# Altium project Taksimetre.PrjPcb (part 1 of 2)
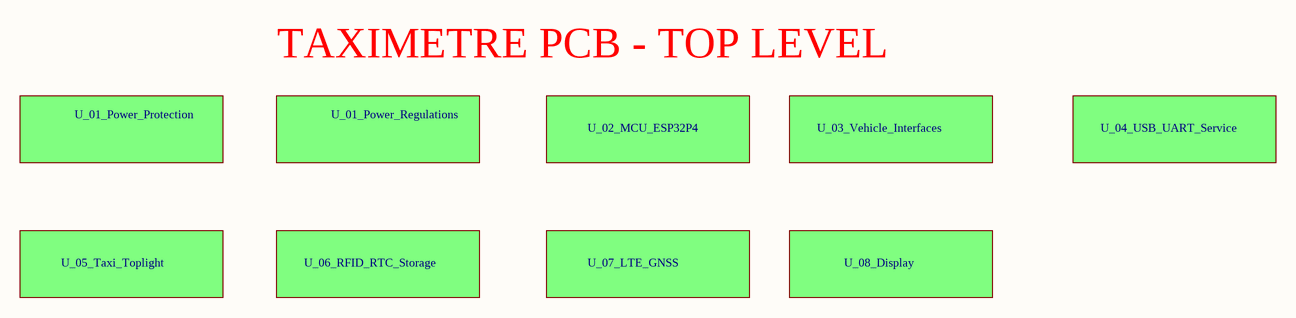
[diagram p0: Taksimetre.SchDoc]
10 sheets, 217 parts. Net scope: flat (ports and power ports of the same name join across sheets).
Sheets:
  Taksimetre.SchDoc
    U_01_Power_Protection = 01_Power_Protection.SchDoc
    U_02_MCU_ESP32P4 = 02_MCU_ESP32P4.SchDoc
    U_03_Vehicle_Interfaces = 03_Vehicle_Interfaces.SchDoc
    U_04_USB_UART_Service = 04_USB_UART_Service.SchDoc
    U_05_Taxi_Toplight = 05_Taxi_Toplight.SchDoc
    U_06_RFID_RTC_Storage = 06_RFID_RTC_Storage.SchDoc
    U_07_LTE_GNSS = 07_LTE_GNSS.SchDoc
    U_08_Display = 08_Display.SchDoc
    U_01_Power_Regulations = 01_Power_Regulations.SchDoc

## Sheet Taksimetre.SchDoc: TAXIMETRE_PCB_MAIN
size A4; Author: YILDIRIM_DOGRU; CompanyName: BARFAS; DrawnBy: YILDIRIM_DOGRU; DocumentNumber: 0

### Sub-sheets
U_01_Power_Protection = 01_Power_Protection.SchDoc: no entries
U_01_Power_Regulations = 01_Power_Regulations.SchDoc: no entries
U_02_MCU_ESP32P4 = 02_MCU_ESP32P4.SchDoc: no entries
U_03_Vehicle_Interfaces = 03_Vehicle_Interfaces.SchDoc: no entries
U_04_USB_UART_Service = 04_USB_UART_Service.SchDoc: no entries
U_05_Taxi_Toplight = 05_Taxi_Toplight.SchDoc: no entries
U_06_RFID_RTC_Storage = 06_RFID_RTC_Storage.SchDoc: no entries
U_07_LTE_GNSS = 07_LTE_GNSS.SchDoc: no entries
U_08_Display = 08_Display.SchDoc: no entries

### Notes on the sheet
- TAXIMETRE PCB - TOP LEVEL
- Title
- Size:
- Date:
- A4
- Drawn By:
- Number:
- Revision:
- File:

## Sheet 01_Power_Protection.SchDoc: POWER
size A4; DrawnBy: YILDIRIM_DOGRU
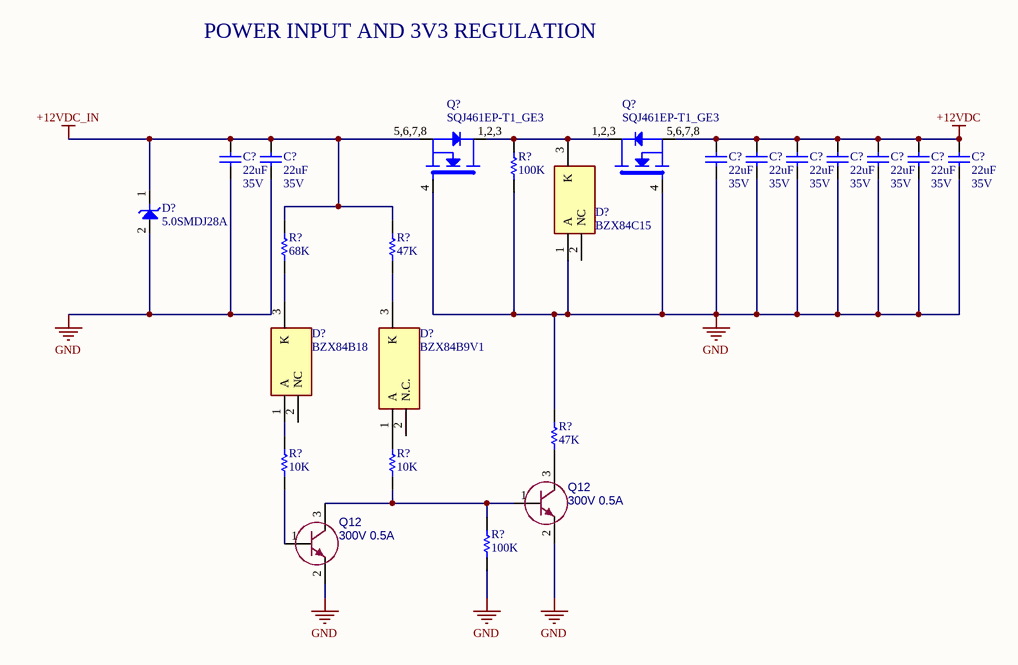
[diagram p1: 01_Power_Protection.SchDoc]

### Parts
(Parts that share a designator on the sheet are numbered #1, #2 ... from top to bottom, then left to right.)
C?#1  value 22uF  Voltage: 35V  [CAP_0805]  (hidden comment: GMC21X5R226M35NT)
C?#2  value 22uF  Voltage: 35V  [CAP_0805]  (hidden comment: GMC21X5R226M35NT)
C?#3  value 22uF  Voltage: 35V  [CAP_0805]  (hidden comment: GMC21X5R226M35NT)
C?#4  value 22uF  Voltage: 35V  [CAP_0805]  (hidden comment: GMC21X5R226M35NT)
C?#5  value 22uF  Voltage: 35V  [CAP_0805]  (hidden comment: GMC21X5R226M35NT)
C?#6  value 22uF  Voltage: 35V  [CAP_0805]  (hidden comment: GMC21X5R226M35NT)
C?#7  value 22uF  Voltage: 35V  [CAP_0805]  (hidden comment: GMC21X5R226M35NT)
C?#8  value 22uF  Voltage: 35V  [CAP_0805]  (hidden comment: GMC21X5R226M35NT)
C?#9  value 22uF  Voltage: 35V  [CAP_0805]  (hidden comment: GMC21X5R226M35NT)
D?#1  5.0SMDJ28A  [SMCJ58A]
D?#2  BZX84C15  [SOT95P240X120-3N]
D?#3  BZX84B18  [SOT95P240X110-3N]
D?#4  BZX84B9V1  [SOT95P240X110-3N]
Q12#1  value 300V 0.5A  [SOT-23-3]  (hidden comment: MMBTA42_R1_00001)
Q12#2  value 300V 0.5A  [SOT-23-3]  (hidden comment: MMBTA42_R1_00001)
Q?#1  SQJ461EP-T1_GE3  [SOT323]
Q?#2  SQJ461EP-T1_GE3  [SOT323]
R?#1  value 100K  [RES_0402]  (hidden comment: 0402WGF1003TCE)
R?#2  value 68K  [RES_0402]  (hidden comment: 0402WGF6802TCE)
R?#3  value 47K  [RES_0603]  (hidden comment: 0603SAF4702T5E)
R?#4  value 47K  [RES_0603]  (hidden comment: 0603SAF4702T5E)
R?#5  value 10K  [RES_0402]  (hidden comment: RC0402JR-0710KL)
R?#6  value 10K  [RES_0402]  (hidden comment: RC0402JR-0710KL)
R?#7  value 100K  [RES_0402]  (hidden comment: 0402WGF1003TCE)

### Nets
+12VDC: C?#3.1 C?#4.1 C?#5.1 C?#6.1 C?#7.1 C?#8.1 C?#9.1 Q?#2.5,6,7,8(S)
+12VDC_IN: C?#1.1 C?#2.1 D?#1.1 Q?#1.5,6,7,8(S) R?#2.2 R?#3.2
GND: C?#1.2 C?#2.2 C?#3.2 C?#4.2 C?#5.2 C?#6.2 C?#7.2 C?#8.2 C?#9.2 D?#1.2 D?#2.1(A) Q12#1.2(E) Q12#2.2(E) Q?#1.4(G) Q?#2.4(G) R?#1.1 R?#4.2 R?#7.1  [project net TVSS]
NetD?#2_3: D?#2.3(K) Q?#1.1,2,3(D) Q?#2.1,2,3(D) R?#1.2
NetD?#3_1: D?#3.1(A) R?#5.2
NetD?#3_3: D?#3.3(K) R?#2.1
NetD?#4_1: D?#4.1(A) R?#6.2
NetD?#4_3: D?#4.3(K) R?#3.1
NetQ12#1_1: Q12#1.1(B) Q12#2.3(C) R?#6.1 R?#7.2
NetQ12#1_3: Q12#1.3(C) R?#4.1
NetQ12#2_1: Q12#2.1(B) R?#5.1

Not connected (* = marked no-connect by the designer): D?#2 2(NC); D?#3 2(NC); D?#4 2(N.C.)

### Notes on the sheet
- POWER INPUT AND 3V3 REGULATION
- Title
- Size:
- Date:
- A4
- Drawn By:
- Number:
- Revision:
- File:

### Library data of the parts
C?#1-C?#9 = C01758: 22 µF ±20% 35V Ceramic Capacitor X5R 0805 (2012 Metric); Manufacturer: Cal-Chip Electronics, Inc.; Manufacturer Part Number: GMC21X5R226M35NT
D?#1 = 5.0SMDJ28A: 45.4V Clamp 110A Ipp Tvs Diode Surface Mount DO-214AB (SMC); Manufacturer: Bourns Inc.; Datasheet Link: https://www.diodes.com/part/view/SMCJ58A; Height: 2.5mm; Manufacturer Part Number: 5.0SMDJ28A; Mouser Part Number: N/A; Mouser Price/Stock: https://www.mouser.co.uk/ProductDetail/Diodes-Incorporated/SMCJ58A?qs=evjyFmOIEsnFZCuxUMyzBg%3D%3D
D?#2 = BZX84C15: Zener Diode; Manufacturer: Diotec; Manufacturer Part Number: BZX84C15
D?#3 = BZX84B18: Zener Diode; Manufacturer: PANJIT; Manufacturer Part Number: BZX84B18
D?#4 = BZX84B9V1: Zener Diode; Manufacturer: PANJIT; Manufacturer Part Number: BZX84B9V1
Q12#1 Q12#2 = MMBTA42_R1_00001: TRANSISTOR DIS.500mA 300V NPN SOT23 GEN. SMT; Manufacturer: PANJIT; Package: SOT23; Supplier Part Number 1: 3757-MMBTA42_R1_00001CT-ND; Supplier Part Number 2: *; Supplier Part Number 3: MMBTA42_R1_00001; Supplier 1: DIGIKEY; Supplier 2: MOUSER; Supplier 3: OZDISAN; Manufacturer Part Number: MMBTA42_R1_00001
Q?#1 Q?#2 = SQJ461EP-T1_GE3: P-Channel 60 V 30A (Tc) 83W (Tc) Surface Mount PowerPAK® SO-8; Manufacturer: Vishay Siliconix; Value: *; Supplier 1: OZDISAN; Manufacturer Part Number: SQJ461EP-T1_GE3
R?#1 R?#7 = R03000: RES.(1005) 0402 100K Ohms 1% 1/16W 100PPM; Manufacturer: ROYALOHM; Manufacturer Part Number: 0402WGF1003TCE
R?#2 = R03000: RES.(1005) 0402 68K Ohms 1% 1/16W 100PPM; Manufacturer: ROYALOHM; Manufacturer Part Number: 0402WGF6802TCE
R?#3 R?#4 = 0603SAF4702T5E: RES.(1608) 0603 47K Ohms 1% 1/10W-S 100PPM; Manufacturer: ROYALOHM; Supplier 1: Ozdisan; Manufacturer Part Number: 0603SAF4702T5E
R?#5 R?#6 = R03000: RES.(1005) 0402 10K Ohms 5% 1/16W 100PPM SMT; Manufacturer: YAGEO; Manufacturer Part Number: RC0402JR-0710KL

## Sheet 02_MCU_ESP32P4.SchDoc: MCU_ESP32P4
size A3; DrawnBy: YILDIRIM_DOGRU
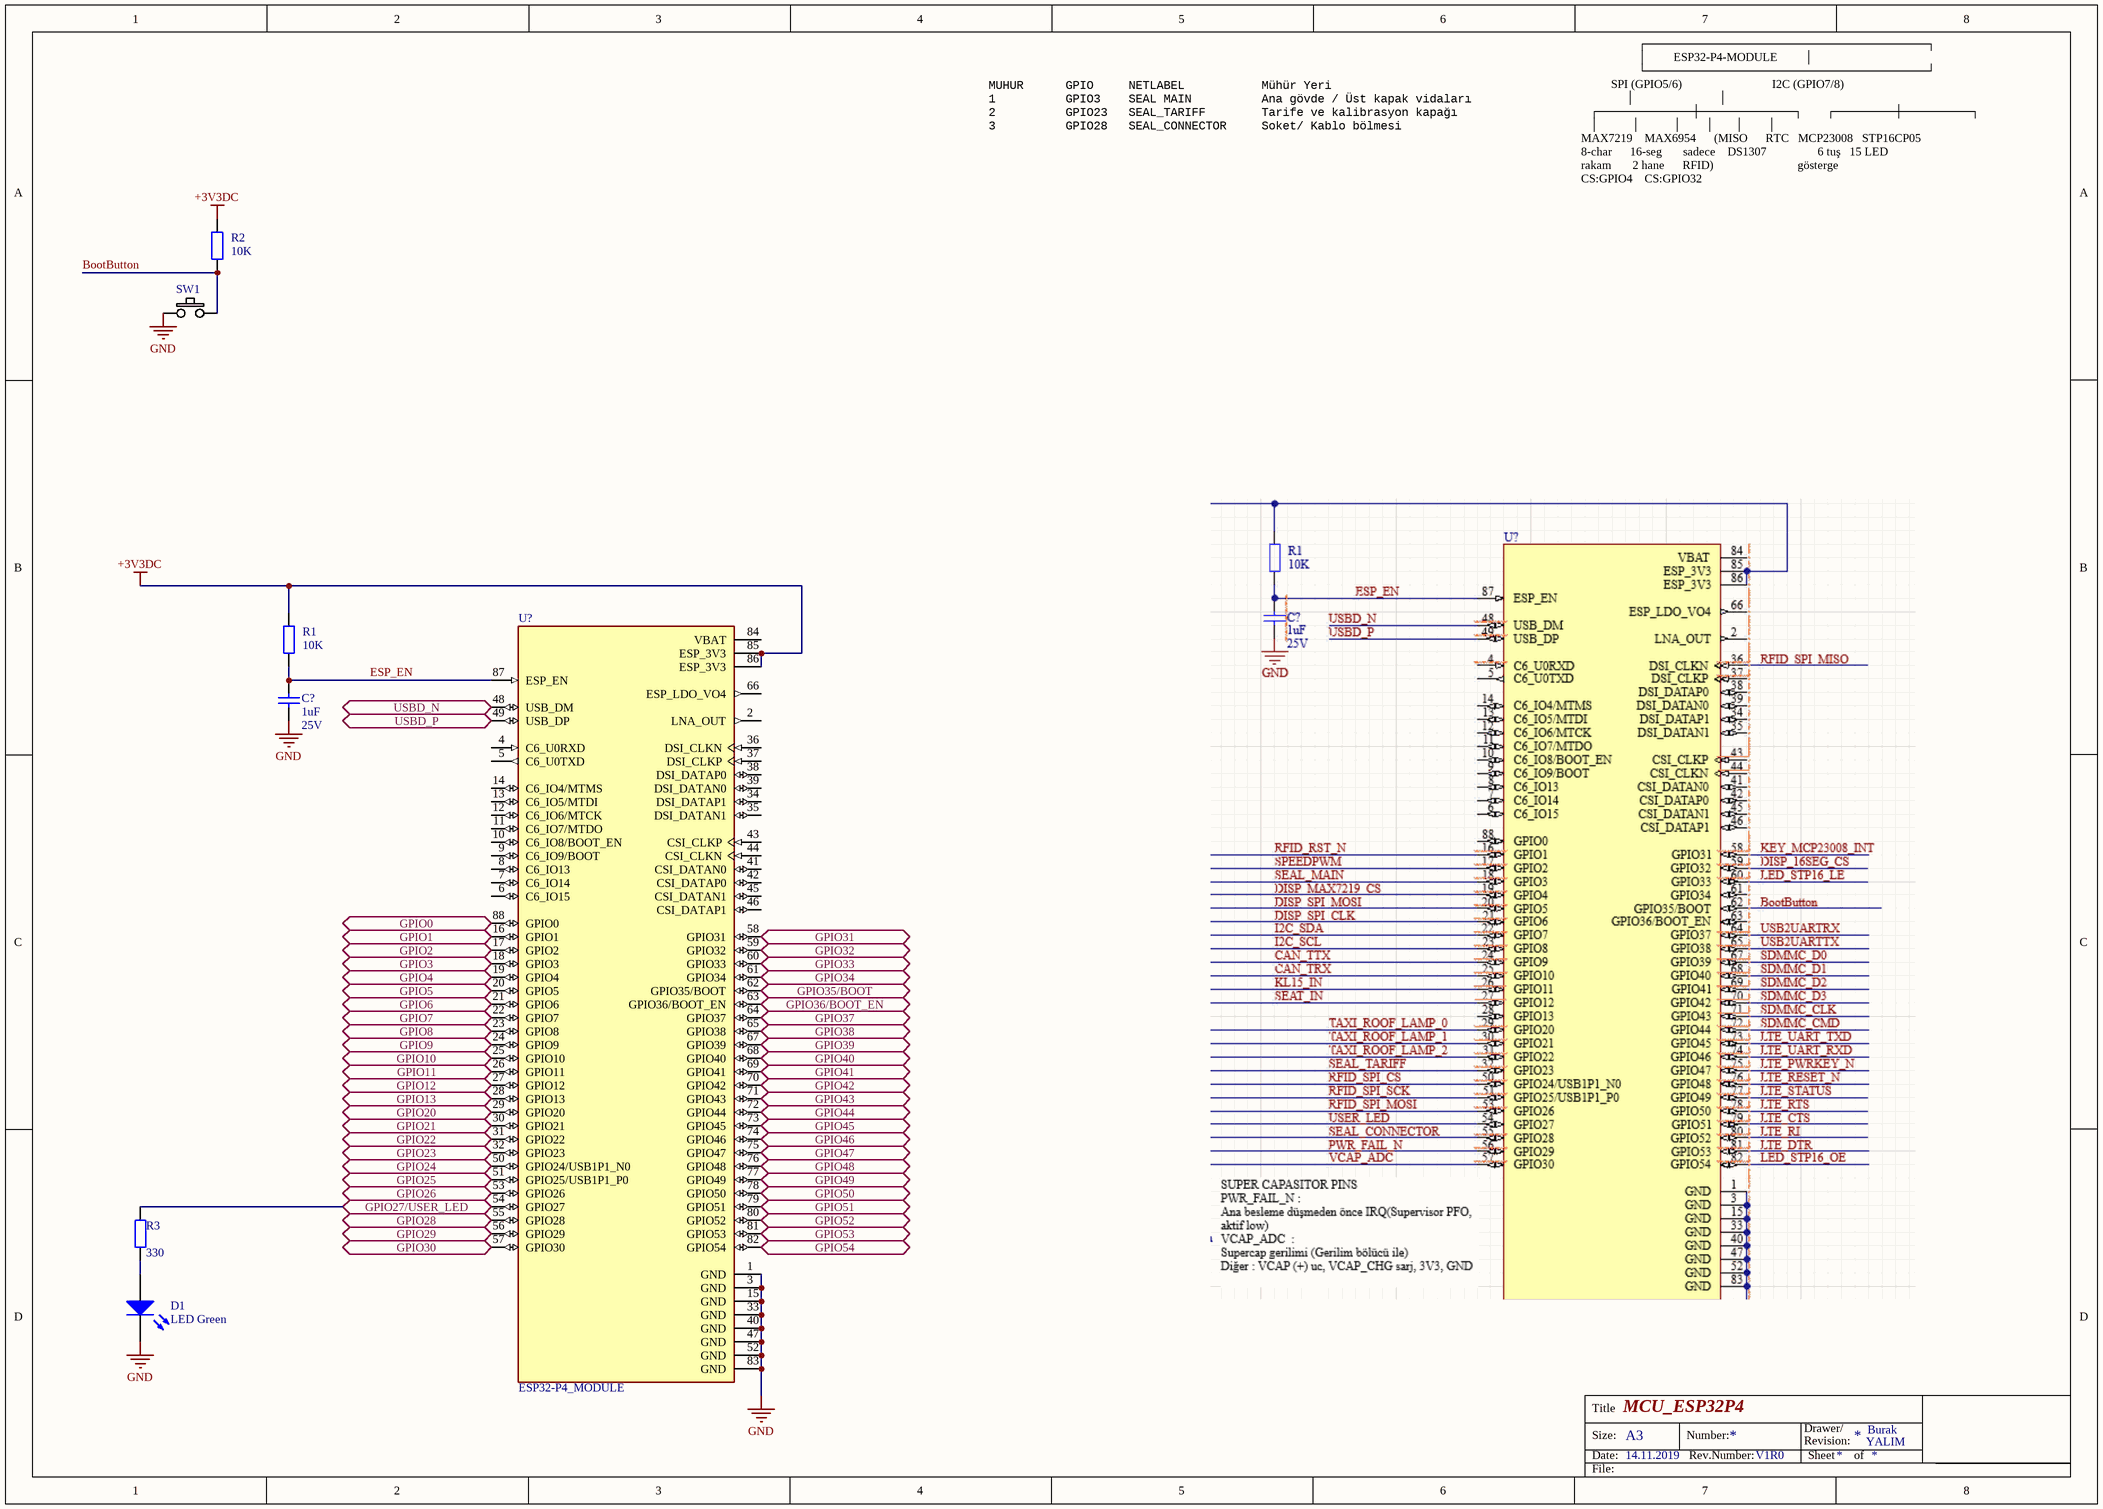
[diagram p2: 02_MCU_ESP32P4.SchDoc]

### Parts
(Parts that share a designator on the sheet are numbered #1, #2 ... from top to bottom, then left to right.)
C?#10  value 1uF  Voltage: 25V  [CAP_0603]  (hidden comment: CL10A105KA8NNNC)
D1#1  LED Green  [LED-1]
R1#1  value 10K  [AXIAL-0.4]  (hidden comment: R_CS)
R2#1  value 10K  [AXIAL-0.4]  (hidden comment: R_CS)
R3#1  value 330  [AXIAL-0.4]  (hidden comment: RG)
SW1#1  SW-PB-BLACK-SMD  [SW-PB-SMD]  (value not drawn)
U?#1  ESP32-P4_MODULE  [XCVR_ESP32-P4_MODULE]

### Ports
GPIO0 (bidir), GPIO1 (bidir), GPIO2 (bidir), GPIO3 (bidir), GPIO4 (bidir), GPIO5 (bidir), GPIO6 (bidir), GPIO7 (bidir), GPIO8 (bidir), GPIO9 (bidir), GPIO10 (bidir), GPIO11 (bidir), GPIO12 (bidir), GPIO13 (bidir), GPIO20 (bidir), GPIO21 (bidir), GPIO22 (bidir), GPIO23 (bidir), GPIO24 (bidir), GPIO25 (bidir), GPIO26 (bidir), GPIO27/USER_LED (bidir), GPIO28 (bidir), GPIO29 (bidir), GPIO30 (bidir), GPIO31 (bidir), GPIO32 (bidir), GPIO33 (bidir), GPIO34 (bidir), GPIO35/BOOT (bidir), GPIO36/BOOT_EN (bidir), GPIO37 (bidir), GPIO38 (bidir), GPIO39 (bidir), GPIO40 (bidir), GPIO41 (bidir), GPIO42 (bidir), GPIO43 (bidir), GPIO44 (bidir), GPIO45 (bidir), GPIO46 (bidir), GPIO47 (bidir), GPIO48 (bidir), GPIO49 (bidir), GPIO50 (bidir), GPIO51 (bidir), GPIO52 (bidir), GPIO53 (bidir), GPIO54 (bidir), USBD_N (bidir), USBD_P (bidir)

### Nets
+3V3DC: R1#1.2 R2#1.2 U?#1.85(ESP_3V3) U?#1.86(ESP_3V3)
GND: C?#10.2 D1#1.2(K) SW1#1.1 U?#1.1(GND) U?#1.3(GND) U?#1.15(GND) U?#1.33(GND) U?#1.40(GND) U?#1.47(GND) U?#1.52(GND) U?#1.83(GND)  [project net TVSS]
BootButton: R2#1.1 SW1#1.2
ESP_EN: C?#10.1 R1#1.1 U?#1.87(ESP_EN)
USBD_N: U?#1.48(USB_DM) ; port USBD_N
USBD_P: U?#1.49(USB_DP) ; port USBD_P
NetD1#1_1: D1#1.1(A) R3#1.1
NetR3#1_2: R3#1.2 U?#1.54(GPIO27) ; port GPIO27/USER_LED
NetU?#1_16: U?#1.16(GPIO1) ; port GPIO1
NetU?#1_17: U?#1.17(GPIO2) ; port GPIO2
NetU?#1_18: U?#1.18(GPIO3) ; port GPIO3
NetU?#1_19: U?#1.19(GPIO4) ; port GPIO4
NetU?#1_20: U?#1.20(GPIO5) ; port GPIO5
NetU?#1_21: U?#1.21(GPIO6) ; port GPIO6
NetU?#1_22: U?#1.22(GPIO7) ; port GPIO7
NetU?#1_23: U?#1.23(GPIO8) ; port GPIO8
NetU?#1_24: U?#1.24(GPIO9) ; port GPIO9
NetU?#1_25: U?#1.25(GPIO10) ; port GPIO10
NetU?#1_26: U?#1.26(GPIO11) ; port GPIO11
NetU?#1_27: U?#1.27(GPIO12) ; port GPIO12
NetU?#1_28: U?#1.28(GPIO13) ; port GPIO13
NetU?#1_29: U?#1.29(GPIO20) ; port GPIO20
NetU?#1_30: U?#1.30(GPIO21) ; port GPIO21
NetU?#1_31: U?#1.31(GPIO22) ; port GPIO22
NetU?#1_32: U?#1.32(GPIO23) ; port GPIO23
NetU?#1_50: U?#1.50(GPIO24/USB1P1_N0) ; port GPIO24
NetU?#1_51: U?#1.51(GPIO25/USB1P1_P0) ; port GPIO25
NetU?#1_53: U?#1.53(GPIO26) ; port GPIO26
NetU?#1_55: U?#1.55(GPIO28) ; port GPIO28
NetU?#1_56: U?#1.56(GPIO29) ; port GPIO29
NetU?#1_57: U?#1.57(GPIO30) ; port GPIO30
NetU?#1_58: U?#1.58(GPIO31) ; port GPIO31
NetU?#1_59: U?#1.59(GPIO32) ; port GPIO32
NetU?#1_60: U?#1.60(GPIO33) ; port GPIO33
NetU?#1_61: U?#1.61(GPIO34) ; port GPIO34
NetU?#1_62: U?#1.62(GPIO35/BOOT) ; port GPIO35/BOOT
NetU?#1_63: U?#1.63(GPIO36/BOOT_EN) ; port GPIO36/BOOT_EN
NetU?#1_64: U?#1.64(GPIO37) ; port GPIO37
NetU?#1_65: U?#1.65(GPIO38) ; port GPIO38
NetU?#1_67: U?#1.67(GPIO39) ; port GPIO39
NetU?#1_68: U?#1.68(GPIO40) ; port GPIO40
NetU?#1_69: U?#1.69(GPIO41) ; port GPIO41
NetU?#1_70: U?#1.70(GPIO42) ; port GPIO42
NetU?#1_71: U?#1.71(GPIO43) ; port GPIO43
NetU?#1_72: U?#1.72(GPIO44) ; port GPIO44
NetU?#1_73: U?#1.73(GPIO45) ; port GPIO45
NetU?#1_74: U?#1.74(GPIO46) ; port GPIO46
NetU?#1_75: U?#1.75(GPIO47) ; port GPIO47
NetU?#1_76: U?#1.76(GPIO48) ; port GPIO48
NetU?#1_77: U?#1.77(GPIO49) ; port GPIO49
NetU?#1_78: U?#1.78(GPIO50) ; port GPIO50
NetU?#1_79: U?#1.79(GPIO51) ; port GPIO51
NetU?#1_80: U?#1.80(GPIO52) ; port GPIO52
NetU?#1_81: U?#1.81(GPIO53) ; port GPIO53
NetU?#1_82: U?#1.82(GPIO54) ; port GPIO54
NetU?#1_88: U?#1.88(GPIO0) ; port GPIO0

Not connected (* = marked no-connect by the designer): U?#1 2(LNA_OUT) 4(C6_U0RXD) 5(C6_U0TXD) 6(C6_IO15) 7(C6_IO14) 8(C6_IO13) 9(C6_IO9/BOOT) 10(C6_IO8/BOOT_EN) 11(C6_IO7/MTDO) 12(C6_IO6/MTCK) 13(C6_IO5/MTDI) 14(C6_IO4/MTMS) 34(DSI_DATAP1) 35(DSI_DATAN1) 36(DSI_CLKN) 37(DSI_CLKP) 38(DSI_DATAP0) 39(DSI_DATAN0) 41(CSI_DATAN0) 42(CSI_DATAP0) 43(CSI_CLKP) 44(CSI_CLKN) 45(CSI_DATAN1) 46(CSI_DATAP1) 66(ESP_LDO_VO4) 84(VBAT)

### Notes on the sheet
- MUHUR      GPIO     NETLABEL           Mühür Yeri
  1          GPIO3    SEAL MAIN          Ana gövde / Üst kapak vidaları
  2          GPIO23   SEAL_TARIFF        Tarife ve kalibrasyon kapağı
  3          GPIO28   SEAL_CONNECTOR     Soket/ Kablo bölmesi
- ┌─────────────────────────────────┐
  │         ESP32-P4-MODULE         │
  └─────────────────────────────────┘
  SPI (GPIO5/6)                              I2C (GPIO7/8)
  │                            │
  ┌───────────┼───────────┐        ┌───────┼────────┐
  │           │           │        │       │        │
  MAX7219    MAX6954      (MISO      RTC   MCP23008   STP16CP05
  8-char      16-seg       sadece    DS1307                 6 tuş   15 LED
  rakam       2 hane      RFID)                            gösterge
  CS:GPIO4    CS:GPIO32
- Title
- Size:
- Date:
- 14.11.2019
- A3
- Number:
- Rev.Number:
- V1R0
- Revision:
- Drawer/
- Sheet
- of
- YALIM
- Burak
- File:

### Library data of the parts
C?#10 = C01757: CAP CER 1UF 25VDC %10 X5R SMD; Manufacturer: Samsung; Manufacturer Part Number: CL10A105KA8NNNC
D1#1 = LED1: Typical RED GaAs LED; Published: 8-Jun-2000; LatestRevisionDate: 08-Jul-2005; LatestRevisionNote: Mech Layer 1 removed.; PackageReference: LED-1; Publisher: Altium Limited; PackageDescription: LED; 2 Leads
R1#1 R2#1 R3#1 = Res2: Resistor; Published: 8-Jun-2000; LatestRevisionDate: 17-Jul-2002; LatestRevisionNote: Re-released for DXP Platform.; PackageReference: AXIAL-0.4; Publisher: Altium Limited; PackageDescription: Axial Device, Thru-Hole; 2 Leads; 0.4 in Pin Spacing
SW1#1 = SW-PB-BLACK-SMD: PUSHBUTTON SWITCH 6MM SMD
U?#1 = ESP32-P4_MODULE: Dual-core RISC-V high-performance module ESP32-C6H8; Manufacturer: Waveshare Electronics; Manufacturer Part Number: ESP32-P4 Module; Value: *

## Sheet 03_Vehicle_Interfaces.SchDoc: Vehicle Interfaces
size A4; DrawnBy: YILDIRIM_DOGRU
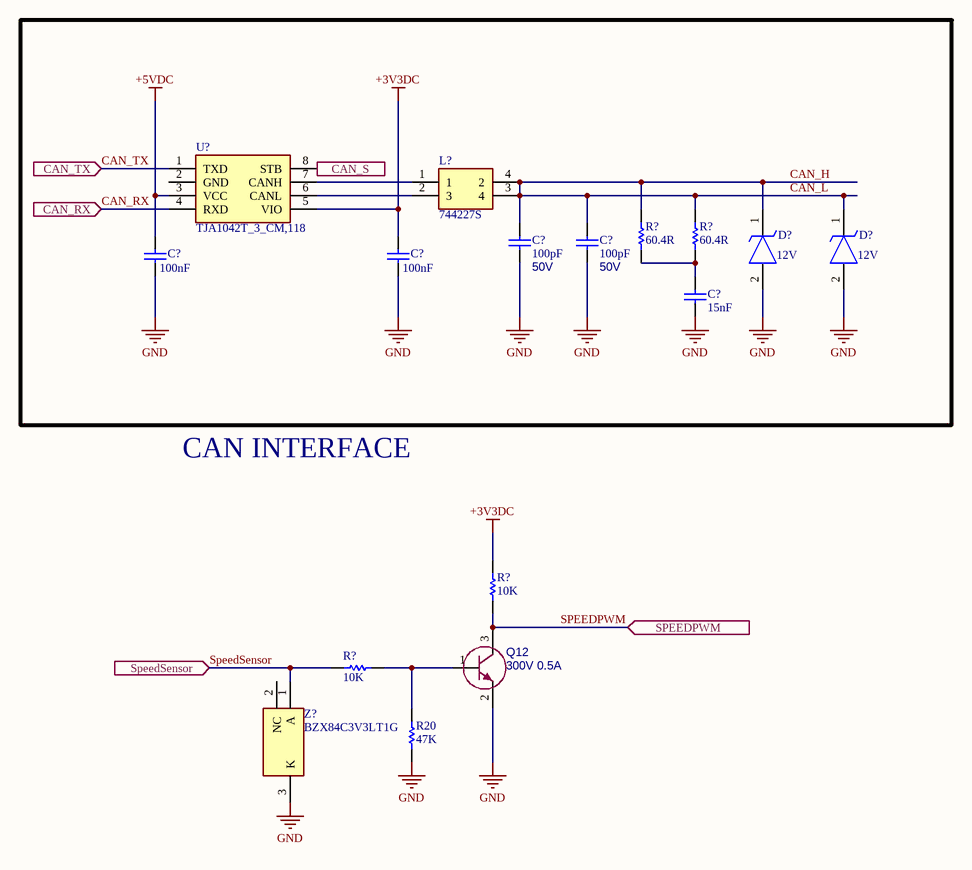
[diagram p3: 03_Vehicle_Interfaces.SchDoc]

### Parts
(Parts that share a designator on the sheet are numbered #1, #2 ... from top to bottom, then left to right.)
C?#11  value 100pF  Voltage: 50V  [CAP_0402]  (hidden comment: CC0402JRNPO9BN101)
C?#12  value 100pF  Voltage: 50V  [CAP_0402]  (hidden comment: CC0402JRNPO9BN101)
C?#13  value 100nF  [CAP_0603]  (hidden comment: CL10B104KB8NNNL)
C?#14  value 100nF  [CAP_0603]  (hidden comment: CL10B104KB8NNNL)
C?#15  value 15nF  [CAP_0603]  (hidden comment: CL10B153KB85PNC)
D?#5  value 12V  [DIOM5436X244N]  (hidden comment: SMBJ12A)
D?#6  value 12V  [DIOM5436X244N]  (hidden comment: SMBJ12A)
L?#1  744227S  [WE-SL274]
Q12#3  value 300V 0.5A  [SOT-23-3]  (hidden comment: MMBTA42_R1_00001)
R20#1  value 47K  [RES_0603]  (hidden comment: 0603SAF4702T5E)
R?#8  value 60.4R  [RES_0603]  (hidden comment: 0603SAF604JT5E)
R?#9  value 60.4R  [RES_0603]  (hidden comment: 0603SAF604JT5E)
R?#10  value 10K  [RES_0402]  (hidden comment: RC0402JR-0710KL)
R?#11  value 10K  [RES_0402]  (hidden comment: RC0402JR-0710KL)
U?#2  TJA1042T_3_CM,118  [SOIC127P600X175-8N]
Z?  BZX84C3V3LT1G  [SOT96P237X111-3N]

### Ports
CAN_RX (in), CAN_S (in), CAN_TX (in), SPEEDPWM (in), SpeedSensor (in)

### Nets
+3V3DC: C?#14.2 R?#10.1 U?#2.5(VIO)
+5VDC: C?#13.2 U?#2.3(VCC)
GND: C?#11.2 C?#12.2 C?#13.1 C?#14.1 C?#15.1 D?#5.2(A) D?#6.2(A) Q12#3.2(E) R20#1.1 Z?.3(K)  [project net TVSS]
CAN_H: C?#11.1 C?#12.1 D?#5.1(K) D?#6.1(K) L?#1.3(4) L?#1.4(2) R?#8.2 R?#9.2  [also labelled CAN_L]
CAN_RX: U?#2.4(RXD) ; port CAN_RX
CAN_TX: U?#2.1(TXD) ; port CAN_TX
SPEEDPWM: Q12#3.3(C) R?#10.2 ; port SPEEDPWM
SpeedSensor: R?#11.1 Z?.1(A) ; port SpeedSensor
NetC?#15_2: C?#15.2 R?#8.1 R?#9.1
NetL?#1_1: L?#1.1 U?#2.7(CANH)
NetL?#1_2: L?#1.2(3) U?#2.6(CANL)
NetQ12#3_1: Q12#3.1(B) R20#1.2 R?#11.2
NetU?#2_8: U?#2.8(STB) ; port CAN_S

Not connected (* = marked no-connect by the designer): U?#2 2(GND); Z? 2(NC)

### Notes on the sheet
- CAN INTERFACE
- Title
- Size:
- Date:
- A4
- Drawn By:
- Number:
- Revision:
- File:

### Library data of the parts
C?#11 C?#12 = CL10B103KB8NNNL: MLCC (1005) 0402 100pF 50VDC ±5% C0G (NP0); Manufacturer: YAGEO; Manufacturer Part Number: CC0402JRNPO9BN101
C?#13 C?#14 = CL10B104KB8NNNL: MLCC (1608) 0603 100nF 50VDC ±10% X7R; Manufacturer: Samsung Electro-Mechanics America, Inc; Supplier 1: OZDISAN; Manufacturer Part Number: CL10B104KB8NNNL
C?#15 = CL10B153KB85PNC: MLCC (1608) 0603 15nF 50VDC ±10% X7R AUTOMOTIVE; Manufacturer: SAMSUNG; Supplier 1: OZDISAN; Manufacturer Part Number: CL10B153KB85PNC
D?#5 D?#6 = SMBJ12A: TVS, UNI-DIR, 600W, 12V, DO-214A; Manufacturer: Good-Ark Semiconductor; Manufacturer Part Number: SMBJ12A
L?#1 = 744227S: Inductor; Manufacturer_Name: Wurth Elektronik; Datasheet Link: https://www.we-online.com/catalog/datasheet/744227S.pdf; Height: 5mm; Manufacturer_Part_Number: 744227S; Mouser Part Number: 710-744227S; Mouser Price/Stock: https://www.mouser.co.uk/ProductDetail/Wurth-Elektronik/744227S?qs=PGXP4M47uW6UzRbcLRn7mw%3D%3D
Q12#3 = MMBTA42_R1_00001: as Q12#1 on sheet 01_Power_Protection; Package: SOT23; Supplier Part Number 1: 3757-MMBTA42_R1_00001CT-ND; Supplier Part Number 2: *; Supplier Part Number 3: MMBTA42_R1_00001; Supplier 1: DIGIKEY; Supplier 2: MOUSER; Supplier 3: OZDISAN; Manufacturer Part Number: MMBTA42_R1_00001
R20#1 = 0603SAF4702T5E: as R?#3 on sheet 01_Power_Protection; Supplier 1: Ozdisan; Manufacturer Part Number: 0603SAF4702T5E
R?#8 R?#9 = 0603SAJ0220T5E: RES.(1608) 0603 60.4 Ohms 1% 1/10W-S 200PPM; Manufacturer: ROYALOHM; Supplier 1: Ozdisan; Manufacturer Part Number: 0603SAF604JT5E
R?#10 R?#11 = R03000: as R?#5 on sheet 01_Power_Protection; Manufacturer Part Number: RC0402JR-0710KL
U?#2 = TJA1042T_3_CM,118: Integrated Circuit; Manufacturer_Name: NXP; Manufacturer_Part_Number: TJA1042T/3/CM,118; Datasheet Link: http://www.nxp.com/docs/en/data-sheet/TJA1042.pdf; Height: 1.75mm; Mouser Part Number: 771-TJA1042T/3/CM118; Mouser Price/Stock: https://www.mouser.co.uk/ProductDetail/NXP-Semiconductors/TJA1042T-3-CM118?qs=vbj%2FKoHZRAjPcMNWVApm4A%3D%3D; Arrow Part Number: TJA1042T/3/CM,118; Arrow Price/Stock: https://www.arrow.com/en/products/tja1042t3cm118/nxp-semiconductors.html?utm_currency=USD&region=nac
Z? = BZX84C3V3LT1G: Zener Diode; Manufacturer_Name: onsemi; Datasheet Link: https://www.onsemi.com/pub/Collateral/BZX84C2V4LT1-D.PDF; Height: 1.11mm; Manufacturer_Part_Number: BZX84C3V3LT1G; Mouser Part Number: 863-BZX84C3V3LT1G; Mouser Price/Stock: https://www.mouser.co.uk/ProductDetail/onsemi/BZX84C3V3LT1G?qs=vNc2DXHODiIKL62%252Be6h8Pg%3D%3D; Arrow Part Number: BZX84C3V3LT1G; Arrow Price/Stock: https://www.arrow.com/en/products/bzx84c3v3lt1g/on-semiconductor.html?utm_currency=USD&region=nac

## Sheet 04_USB_UART_Service.SchDoc: USB_UART_Service
size A4; DrawnBy: YILDIRIM_DOGRU
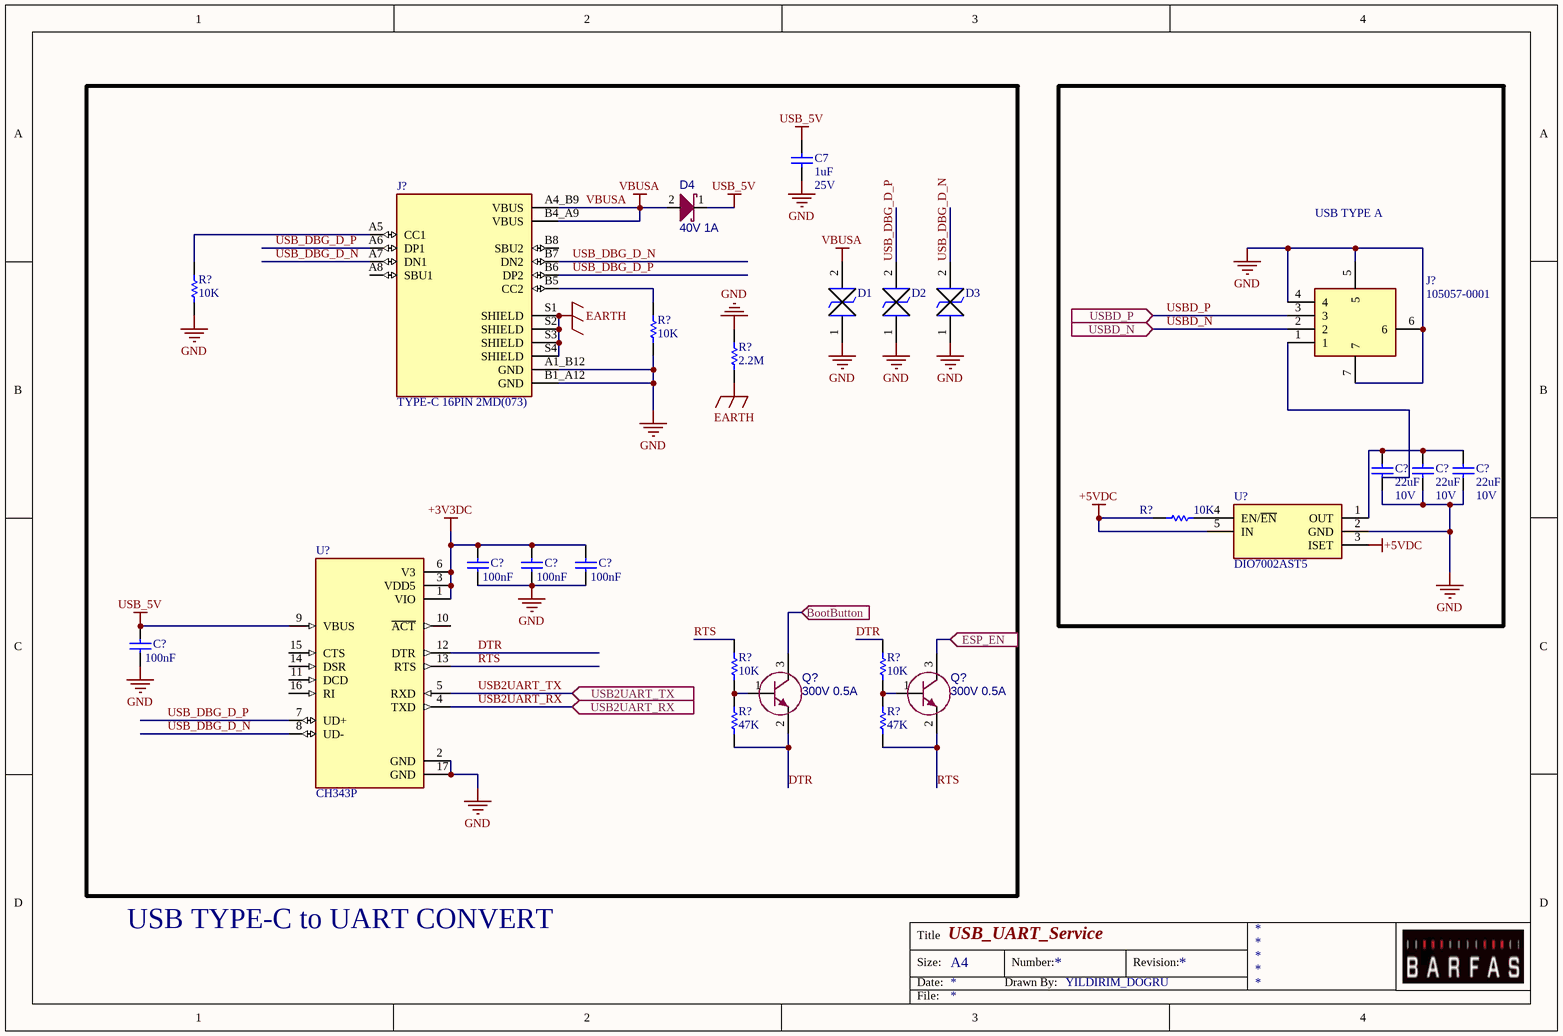
[diagram p4: 04_USB_UART_Service.SchDoc]

### Parts
(Parts that share a designator on the sheet are numbered #1, #2 ... from top to bottom, then left to right.)
C7#1  value 1uF  Voltage: 25V  [CAP_0603]  (hidden comment: CL10A105KA8NNNC)
C?#16  value 22uF  Voltage: 10V  [CAP_0805]  (hidden comment: CL21A226MPCLRNC)
C?#17  value 22uF  Voltage: 10V  [CAP_0805]  (hidden comment: CL21A226MPCLRNC)
C?#18  value 22uF  Voltage: 10V  [CAP_0805]  (hidden comment: CL21A226MPCLRNC)
C?#19  value 100nF  [CAP_0603]  (hidden comment: CL10B104KB8NNNL)
C?#20  value 100nF  [CAP_0603]  (hidden comment: CL10B104KB8NNNL)
C?#21  value 100nF  [CAP_0603]  (hidden comment: CL10B104KB8NNNL)
C?#22  value 100nF  [CAP_0603]  (hidden comment: CL10B104KB8NNNL)
D1#2  ATV02W5V0B-HF  [SODFL3718X130N]  (value not drawn)
D2#1  ATV02W5V0B-HF  [SODFL3718X130N]  (value not drawn)
D3#1  ATV02W5V0B-HF  [SODFL3718X130N]  (value not drawn)
D4  value 40V 1A  [SOD-123]  (hidden comment: PMEG4010EGWJ)
J?#1  TYPE-C 16PIN 2MD(073)  [HRO_TYPE-C-31-M-12]
J?#2  105057-0001  [1050570001]
Q?#3  value 300V 0.5A  [SOT-23-3]  (hidden comment: MMBTA42_R1_00001)
Q?#4  value 300V 0.5A  [SOT-23-3]  (hidden comment: MMBTA42_R1_00001)
R?#12  value 10K  [RES_0402]  (hidden comment: RC0402JR-0710KL)
R?#13  value 10K  [RES_0402]  (hidden comment: RC0402JR-0710KL)
R?#14  value 2.2M  [RES_0805]  (hidden comment: RES)
R?#15  value 10K  [RES_0402]  (hidden comment: RC0402JR-0710KL)
R?#16  value 10K  [RES_0402]  (hidden comment: RC0402JR-0710KL)
R?#17  value 10K  [RES_0402]  (hidden comment: RC0402JR-0710KL)
R?#18  value 47K  [RES_0603]  (hidden comment: 0603SAF4702T5E)
R?#19  value 47K  [RES_0603]  (hidden comment: 0603SAF4702T5E)
U?#3  DIO7002AST5  [SOT95P280X125-5N]
U?#4  CH343P  [QFN50P300X300X80-17N]

### Blocks framed on the sheet
USB TYPE A: C?#16-C?#18 J?#2 R?#15 U?#3

### Ports
BootButton (in), ESP_EN (in), USB2UART_RX (in), USB2UART_TX (in), USBD_N (in), USBD_P (in)

### Nets
+3V3DC: C?#19.2 C?#20.2 C?#21.2 U?#4.1(VIO) U?#4.3(VDD5) U?#4.6(V3)
+5VDC: R?#15.2 U?#3.3(ISET) U?#3.5(IN)
EARTH: J?#1.S1(SHIELD) J?#1.S2(SHIELD) J?#1.S3(SHIELD) J?#1.S4(SHIELD) R?#14.1
GND: C7#1.2 C?#16.2 C?#17.2 C?#18.2 C?#19.1 C?#20.1 C?#21.1 C?#22.1 D1#2.1 D2#1.1 D3#1.1 J?#1.A1_B12(GND) J?#1.B1_A12(GND) J?#2.4 J?#2.5 J?#2.6 J?#2.7 R?#12.1 R?#13.1 R?#14.2 U?#3.2(GND) U?#4.2(GND) U?#4.17(GND)  [project net TVSS]
USB_5V: C7#1.1 C?#22.2 D4.1 U?#4.9(VBUS)
VBUSA: D1#2.2 D4.2 J?#1.A4_B9(VBUS) J?#1.B4_A9(VBUS)
DTR: Q?#3.2(E) R?#17.2 R?#18.1 U?#4.12(DTR)
RTS: Q?#4.2(E) R?#16.2 R?#19.1 U?#4.13(RTS)
USB2UART_RX: U?#4.4(TXD) ; port USB2UART_RX
USB2UART_TX: U?#4.5(RXD) ; port USB2UART_TX
USB_DBG_D_N: D3#1.2 J?#1.A7(DN1) J?#1.B7(DN2) U?#4.8(UD-)
USB_DBG_D_P: D2#1.2 J?#1.A6(DP1) J?#1.B6(DP2) U?#4.7(UD+)
USBD_N: J?#2.2 ; port USBD_N
USBD_P: J?#2.3 ; port USBD_P
NetC?#16_1: C?#16.1 C?#17.1 C?#18.1 U?#3.1(OUT)
NetJ?#1_A5: J?#1.A5(CC1) R?#12.2
NetJ?#1_B5: J?#1.B5(CC2) R?#13.2
NetQ?#3_1: Q?#3.1(B) R?#16.1 R?#18.2
NetQ?#3_3: Q?#3.3(C) ; port BootButton
NetQ?#4_1: Q?#4.1(B) R?#17.1 R?#19.2
NetQ?#4_3: Q?#4.3(C) ; port ESP_EN
NetR?#15_1: R?#15.1 U?#3.4(EN/~{EN})

Not connected (* = marked no-connect by the designer): J?#1 A8(SBU1) B8(SBU2); J?#2 1; U?#4 10(~{ACT}) 11(DCD) 14(DSR) 15(CTS) 16(RI)

### Notes on the sheet
- USB TYPE-C to UART CONVERT
- Title
- Size:
- Date:
- A4
- Drawn By:
- Number:
- Revision:
- File:

### Library data of the parts
C7#1 = C01757: as C?#10 on sheet 02_MCU_ESP32P4; Manufacturer Part Number: CL10A105KA8NNNC
C?#16-C?#18 = C01758: MLCC (2012) 0805 22uF 10VDC ±20% X5R; Manufacturer: Samsung; Manufacturer Part Number: CL21A226MPCLRNC
C?#19-C?#22 = CL10B104KB8NNNL: as C?#13 on sheet 03_Vehicle_Interfaces; Supplier 1: OZDISAN; Manufacturer Part Number: CL10B104KB8NNNL
D1#2 D2#1 D3#1 = ATV02W5V0B-HF: TVS Diode (Bi-directional); Manufacturer: Comchip Technology; Manufacturer Part Number: ATV02W5V0B-HF
D4 = PMEG4010EGWJ: DIODE SCHOTTKY 40V 1A SOD123; Manufacturer: Nexperia USA Inc.; Manufacturer Part Number: PMEG4010EGWJ
J?#1 = TYPE-C-31-M-12: CONN RCPT Type-C 16POS SMD R/A; Manufacturer: SHOU HAN; Value: *; Manufacturer Part Number: TYPE-C 16PIN 2MD(073)
J?#2 = 105057-0001: CONN RCPT USB2.0 TYPEA 4POS VERT; Manufacturer: Molex; Manufacturer Part Number: 105057-0001
Q?#3 Q?#4 = MMBTA42_R1_00001: as Q12#1 on sheet 01_Power_Protection; Package: SOT23; Supplier Part Number 1: 3757-MMBTA42_R1_00001CT-ND; Supplier Part Number 2: *; Supplier Part Number 3: MMBTA42_R1_00001; Supplier 1: DIGIKEY; Supplier 2: MOUSER; Supplier 3: OZDISAN; Manufacturer Part Number: MMBTA42_R1_00001
R?#12 R?#13 R?#15-R?#17 = R03000: as R?#5 on sheet 01_Power_Protection; Manufacturer Part Number: RC0402JR-0710KL
R?#14 = R01913: RES SMD 2.2M OHM 1% 1/8W 0805; Manufacturer: Yageo; Manufacturer Part Number: RC0805FR-072M2L
R?#18 R?#19 = 0603SAF4702T5E: as R?#3 on sheet 01_Power_Protection; Supplier 1: Ozdisan; Manufacturer Part Number: 0603SAF4702T5E
U?#3 = DIO7002AST5: Low Loss Power Distribution Switch; Manufacturer: DIOO Microcircuits; Manufacturer Part Number: DIO7002AST5
U?#4 = CH343P: USB to High-Speed Serial Chip CH343; Manufacturer: WCH; SnapEDA_Link: https://www.snapeda.com/parts/CH343P/WCH/view-part/?ref=snap; Package: Package; Value: *; Manufacturer Part Number: CH343P; Check_prices: https://www.snapeda.com/parts/CH343P/WCH/view-part/?ref=eda

## Sheet 05_Taxi_Toplight.SchDoc: Taxi_Toplight
size A4; DrawnBy: YILDIRIM_DOGRU
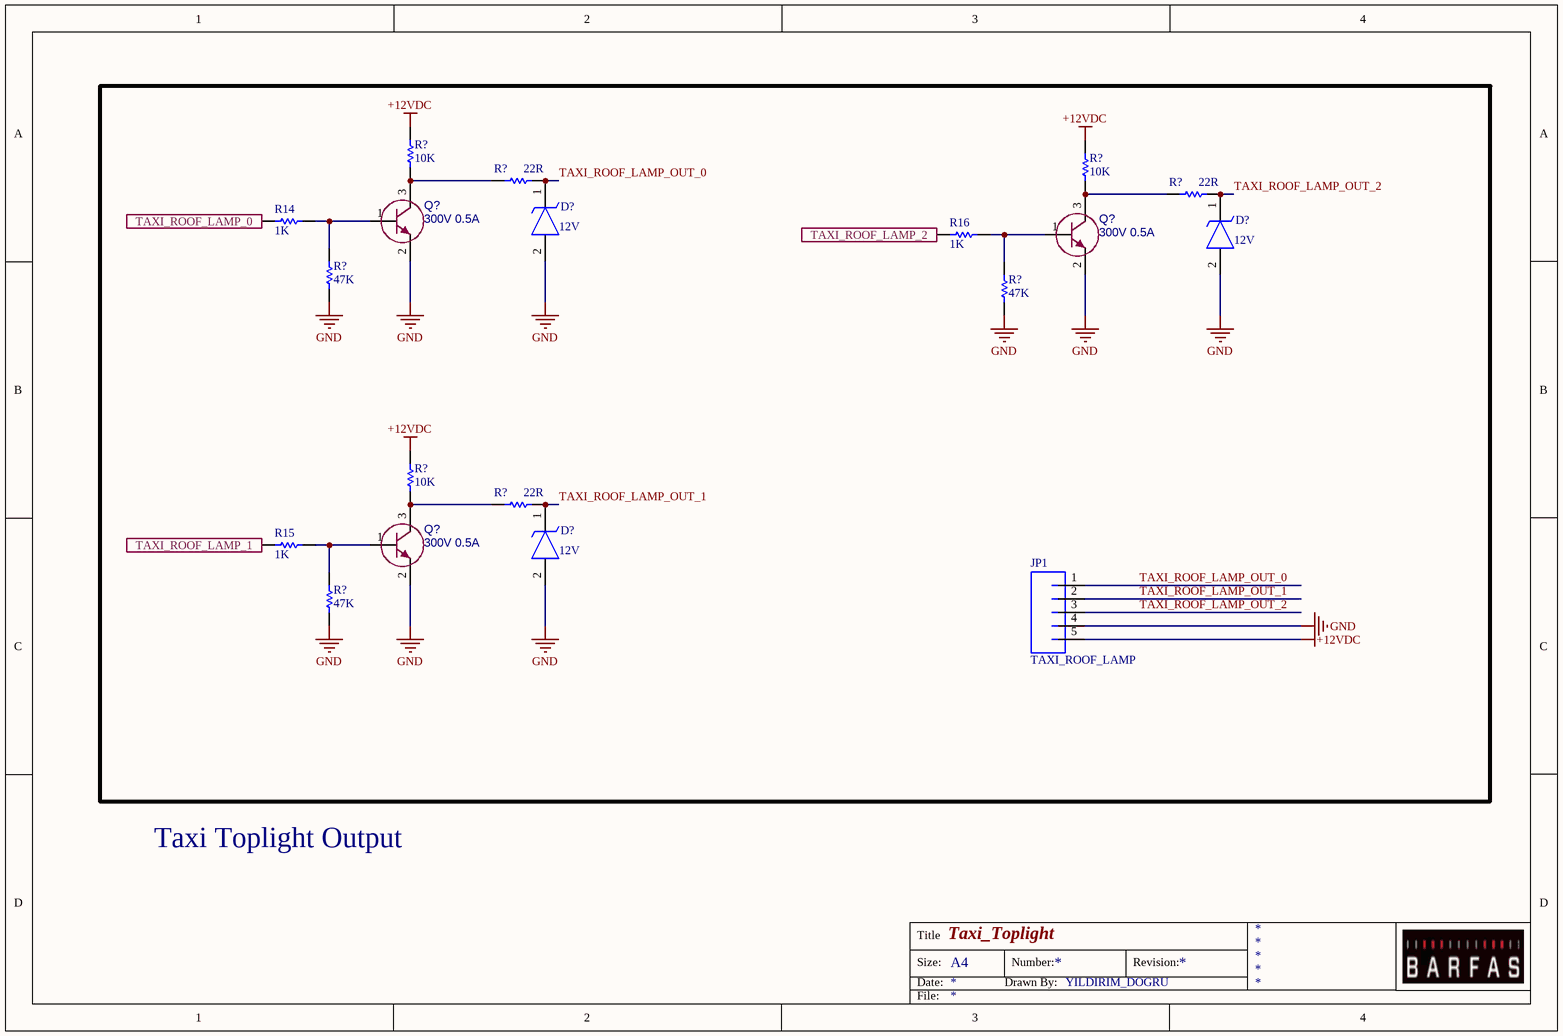
[diagram p5: 05_Taxi_Toplight.SchDoc]

### Parts
(Parts that share a designator on the sheet are numbered #1, #2 ... from top to bottom, then left to right.)
D?#7  value 12V  [DIOM5436X244N]  (hidden comment: SMBJ12A)
D?#8  value 12V  [DIOM5436X244N]  (hidden comment: SMBJ12A)
D?#9  value 12V  [DIOM5436X244N]  (hidden comment: SMBJ12A)
JP1  TAXI_ROOF_LAMP  [JST-XH-5-PTH-VERT]
Q?#5  value 300V 0.5A  [SOT-23-3]  (hidden comment: MMBTA42_R1_00001)
Q?#6  value 300V 0.5A  [SOT-23-3]  (hidden comment: MMBTA42_R1_00001)
Q?#7  value 300V 0.5A  [SOT-23-3]  (hidden comment: MMBTA42_R1_00001)
R14#1  value 1K  [RES_0603]  (hidden comment: 0603SAF1001T5E)
R15#1  value 1K  [RES_0603]  (hidden comment: 0603SAF1001T5E)
R16#1  value 1K  [RES_0603]  (hidden comment: 0603SAF1001T5E)
R?#20  value 10K  [RES_0402]  (hidden comment: RC0402JR-0710KL)
R?#21  value 10K  [RES_0402]  (hidden comment: RC0402JR-0710KL)
R?#22  value 22R  [RES_0603]  (hidden comment: 0603SAJ0220T5E)
R?#23  value 22R  [RES_0603]  (hidden comment: 0603SAJ0220T5E)
R?#24  value 47K  [RES_0603]  (hidden comment: 0603SAF4702T5E)
R?#25  value 47K  [RES_0603]  (hidden comment: 0603SAF4702T5E)
R?#26  value 10K  [RES_0402]  (hidden comment: RC0402JR-0710KL)
R?#27  value 22R  [RES_0603]  (hidden comment: 0603SAJ0220T5E)
R?#28  value 47K  [RES_0603]  (hidden comment: 0603SAF4702T5E)

### Ports
TAXI_ROOF_LAMP_0 (in), TAXI_ROOF_LAMP_1 (in), TAXI_ROOF_LAMP_2 (in)

### Nets
+12VDC: JP1.5 R?#20.1 R?#21.1 R?#26.1
GND: D?#7.2(A) D?#8.2(A) D?#9.2(A) JP1.4 Q?#5.2(E) Q?#6.2(E) Q?#7.2(E) R?#24.1 R?#25.1 R?#28.1  [project net TVSS]
TAXI_ROOF_LAMP_OUT_0: D?#7.1(K) JP1.1 R?#22.2
TAXI_ROOF_LAMP_OUT_1: D?#9.1(K) JP1.2 R?#27.2
TAXI_ROOF_LAMP_OUT_2: D?#8.1(K) JP1.3 R?#23.2
NetQ?#5_1: Q?#5.1(B) R14#1.1 R?#24.2
NetQ?#5_3: Q?#5.3(C) R?#20.2 R?#22.1
NetQ?#6_1: Q?#6.1(B) R16#1.1 R?#25.2
NetQ?#6_3: Q?#6.3(C) R?#21.2 R?#23.1
NetQ?#7_1: Q?#7.1(B) R15#1.1 R?#28.2
NetQ?#7_3: Q?#7.3(C) R?#26.2 R?#27.1
NetR14#1_2: R14#1.2 ; port TAXI_ROOF_LAMP_0
NetR15#1_2: R15#1.2 ; port TAXI_ROOF_LAMP_1
NetR16#1_2: R16#1.2 ; port TAXI_ROOF_LAMP_2

### Notes on the sheet
- Taxi Toplight Output
- Title
- Size:
- Date:
- A4
- Drawn By:
- Number:
- Revision:
- File:

### Library data of the parts
D?#7-D?#9 = SMBJ12A: as D?#5 on sheet 03_Vehicle_Interfaces; Manufacturer Part Number: SMBJ12A
JP1 = JST_XH_5_VERT: Manufacturer: JST Sales America, Inc.; PartNumber: B5B-XH-A(LF)(SN); Mounting Technology: Through Hole; PackageReference: JST-XH
Q?#5-Q?#7 = MMBTA42_R1_00001: as Q12#1 on sheet 01_Power_Protection; Package: SOT23; Supplier Part Number 1: 3757-MMBTA42_R1_00001CT-ND; Supplier Part Number 2: *; Supplier Part Number 3: MMBTA42_R1_00001; Supplier 1: DIGIKEY; Supplier 2: MOUSER; Supplier 3: OZDISAN; Manufacturer Part Number: MMBTA42_R1_00001
R14#1 R15#1 R16#1 = 0603SAF1001T5E: RES.(1608) 0603 1K Ohms 1% 1/10W-S 100PPM; Manufacturer: ROYALOHM; Supplier 1: Ozdisan; Manufacturer Part Number: 0603SAF1001T5E
R?#20 R?#21 R?#26 = R03000: as R?#5 on sheet 01_Power_Protection; Manufacturer Part Number: RC0402JR-0710KL
R?#22 R?#23 R?#27 = 0603SAJ0220T5E: RES.(1608) 0603 22 Ohms 5% 1/10W-S 200PPM; Manufacturer: ROYALOHM; Supplier 1: Ozdisan; Manufacturer Part Number: 0603SAJ0220T5E
R?#24 R?#25 R?#28 = 0603SAF4702T5E: as R?#3 on sheet 01_Power_Protection; Supplier 1: Ozdisan; Manufacturer Part Number: 0603SAF4702T5E

## Sheet 06_RFID_RTC_Storage.SchDoc: RFID_RTC_Storage
size A4; DrawnBy: YILDIRIM_DOGRU
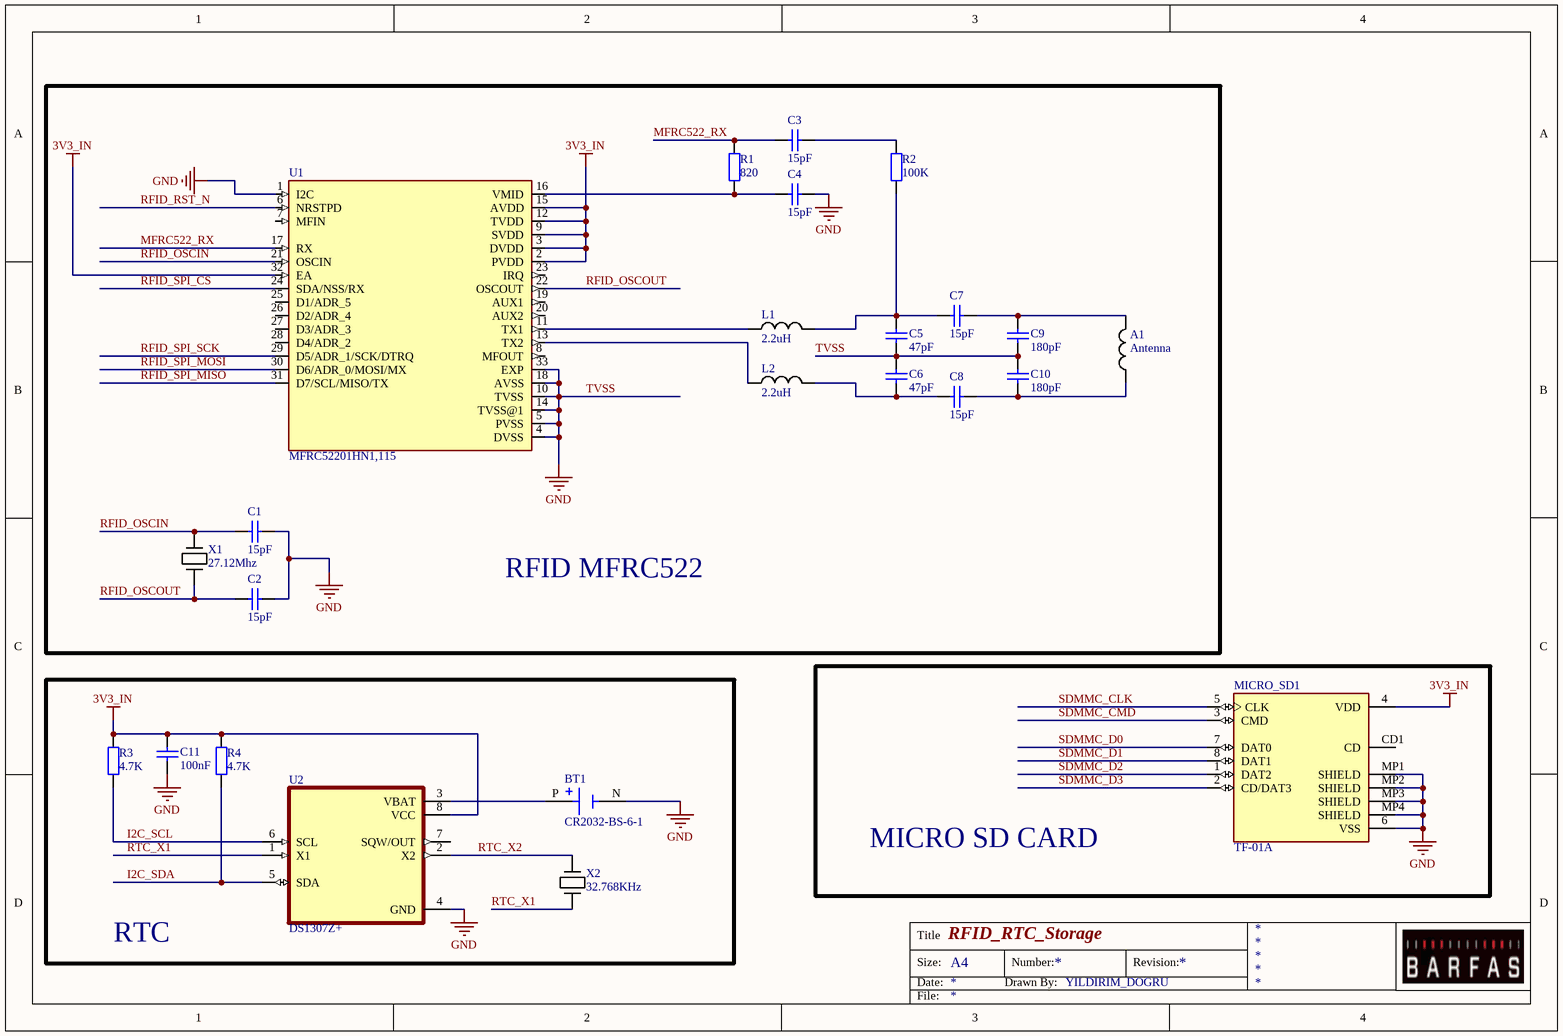
[diagram p6: 06_RFID_RTC_Storage.SchDoc]

### Parts
(Parts that share a designator on the sheet are numbered #1, #2 ... from top to bottom, then left to right.)
A1  Antenna  [TDK-VLS3012-1U]
BT1  CR2032-BS-6-1  [BAT_CR2032-BS-6-1]
C1#1  value 15pF  [RAD-0.3]  (hidden comment: Cap)
C2  value 15pF  [RAD-0.3]  (hidden comment: Cap)
C3  value 15pF  [RAD-0.3]  (hidden comment: Cap)
C4  value 15pF  [RAD-0.3]  (hidden comment: Cap)
C5  value 47pF  [RAD-0.3]  (hidden comment: Cap)
C6  value 47pF  [RAD-0.3]  (hidden comment: Cap)
C7#2  value 15pF  [RAD-0.3]  (hidden comment: Cap)
C8  value 15pF  [RAD-0.3]  (hidden comment: Cap)
C9  value 180pF  [RAD-0.3]  (hidden comment: Cap)
C10  value 180pF  [RAD-0.3]  (hidden comment: Cap)
C11  value 100nF  [RAD-0.3]  (hidden comment: Cap)
L1  2.2uH  [TDK-VLS3012-1U]
L2#1  2.2uH  [TDK-VLS3012-1U]
MICRO_SD1  TF-01A  [TF-01A]
R1#2  value 820  [AXIAL-0.4]  (hidden comment: R_CS)
R2#2  value 100K  [AXIAL-0.4]  (hidden comment: R_CS)
R3#2  value 4.7K  [AXIAL-0.4]  (hidden comment: R_CS)
R4  value 4.7K  [AXIAL-0.4]  (hidden comment: R_CS)
U1#1  MFRC52201HN1,115  [QFN50P500X500X100-33N]
U2#1  DS1307Z+  [SOIC127P600X175-8N]
X1  27.12Mhz  [XTAL-RU49/4]
X2  32.768KHz  [XTAL-RU49/4]

### Blocks framed on the sheet
RFID MFRC522: A1 C1#1 C2-C6 C7#2 C8-C10 L1 L2#1 R1#2 R2#2 U1#1 X1
MICRO SD CARD: MICRO_SD1
RTC: BT1 C11 R3#2 R4 U2#1 X2

### Nets
3V3_IN: C11.1 MICRO_SD1.4(VDD) R3#2.1 R4.1 U1#1.2(PVDD) U1#1.3(DVDD) U1#1.9(SVDD) U1#1.12(TVDD) U1#1.15(AVDD) U1#1.32(EA) U2#1.8(VCC)
TVSS: BT1.N(NEG) C1#1.1 C2.1 C4.1 C5.2 C6.1 C9.2 C10.1 C11.2 MICRO_SD1.6(VSS) MICRO_SD1.MP1(SHIELD) MICRO_SD1.MP2(SHIELD) MICRO_SD1.MP3(SHIELD) MICRO_SD1.MP4(SHIELD) U1#1.1(I2C) U1#1.4(DVSS) U1#1.5(PVSS) U1#1.10(TVSS) U1#1.14(TVSS@1) U1#1.18(AVSS) U1#1.33(EXP) U2#1.4(GND)  [also labelled GND]
I2C_SCL: R3#2.2 U2#1.6(SCL)
I2C_SDA: R4.2 U2#1.5(SDA)
MFRC522_RX: C3.2 R1#2.1 U1#1.17(RX)
RFID_OSCIN: C1#1.2 U1#1.21(OSCIN) X1.1
RFID_OSCOUT: C2.2 U1#1.22(OSCOUT) X1.2
RFID_RST_N: U1#1.6(NRSTPD)
RFID_SPI_CS: U1#1.24(SDA/NSS/RX)
RFID_SPI_MISO: U1#1.31(D7/SCL/MISO/TX)
RFID_SPI_MOSI: U1#1.30(D6/ADR_0/MOSI/MX)
RFID_SPI_SCK: U1#1.29(D5/ADR_1/SCK/DTRQ)
RTC_X1: U2#1.1(X1) X2.2
RTC_X2: U2#1.2(X2) X2.1
SDMMC_CLK: MICRO_SD1.5(CLK)
SDMMC_CMD: MICRO_SD1.3(CMD)
SDMMC_D0: MICRO_SD1.7(DAT0)
SDMMC_D1: MICRO_SD1.8(DAT1)
SDMMC_D2: MICRO_SD1.1(DAT2)
SDMMC_D3: MICRO_SD1.2(CD/DAT3)
NetA1_1: A1.1 C8.1 C10.2
NetA1_2: A1.2 C7#2.1 C9.1
NetBT1_P: BT1.P(POS) U2#1.3(VBAT)
NetC3_1: C3.1 R2#2.1
NetC4_2: C4.2 R1#2.2 U1#1.16(VMID)
NetC5_1: C5.1 C7#2.2 L1.2 R2#2.2
NetC6_2: C6.2 C8.2 L2#1.2
NetL1_1: L1.1 U1#1.11(TX1)
NetL2#1_1: L2#1.1 U1#1.13(TX2)

Not connected (* = marked no-connect by the designer): MICRO_SD1 CD1(CD); U1#1 7(MFIN) 8(MFOUT) 19(AUX1) 20(AUX2) 23(IRQ) 25(D1/ADR_5) 26(D2/ADR_4) 27(D3/ADR_3) 28(D4/ADR_2); U2#1 7(SQW/OUT)

### Notes on the sheet
- Title
- Size:
- Date:
- A4
- Drawn By:
- Number:
- Revision:
- File:

### Library data of the parts
A1 L1 L2#1 = 1U-VLS3012-TDK: TDK-VLS3012-1U; Manufacturer: TDK Corporation; Manufacturer Part Number: VLS3012T-1R0N2R2; Reel: L8; Supplier 1: Digi-Key; Supplier Part Number 1: 445-3682-2-ND
BT1 = CR2032-BS-6-1: Battery base CR2032 SMD Battery Connectors ROHS; MF: Shenzhen Q&J Electronics Co. Ltd; Package: Package; Check_prices: https://www.snapeda.com/parts/CR2032-BS-6-1/Shenzhen+Q%2526J+Electronics+Co.+Ltd/view-part/?ref=eda; SnapEDA_Link: https://www.snapeda.com/parts/CR2032-BS-6-1/Shenzhen+Q%2526J+Electronics+Co.+Ltd/view-part/?ref=snap; MP: CR2032-BS-6-1; Value: *; Availability: Not in stock; Price: None
C1#1 C2-C6 C7#2 C8-C11 = Cap: Capacitor; Published: 8-Jun-2000; LatestRevisionDate: 17-Jul-2002; LatestRevisionNote: Re-released for DXP Platform.; PackageReference: RAD-0.3; Publisher: Altium Limited; PackageDescription: Radial Cap, Thru-Hole; 2 Leads; 0.3 in Pin Spacing
MICRO_SD1 = TF-01A: Standard Card Edge Connectors; MF: HRO Electronics Co., Ltd.; Price: None; Availability: Not in stock; MP: TF-01A; Package: Package; SnapEDA_Link: https://www.snapeda.com/parts/TF-01A/HRO+Electronics+Co.%252C+Ltd./view-part/?ref=snap; Check_prices: https://www.snapeda.com/parts/TF-01A/HRO+Electronics+Co.%252C+Ltd./view-part/?ref=eda; Value: *
R1#2 R2#2 R3#2 R4 = Res2: Resistor; Published: 8-Jun-2000; LatestRevisionDate: 17-Jul-2002; LatestRevisionNote: Re-released for DXP Platform.; PackageReference: AXIAL-0.4; Publisher: Altium Limited; PackageDescription: Axial Device, Thru-Hole; 2 Leads; 0.4 in Pin Spacing
U1#1 = MFRC52201HN1,115: RFID Reader IC 13.56MHz ISO 14443, MIFARE IÂ²C, SPI, UART 2.5V ~ 3.3V 32-VFQFN Exposed Pad; MF: NXP Semiconductors; SnapEDA_Link: https://www.snapeda.com/parts/MFRC52201HN1,115/NXP+Semiconductors/view-part/?ref=snap; Package: VFQFN-32 NXP Semiconductors; Value: *; MP: MFRC52201HN1,115; Check_prices: https://www.snapeda.com/parts/MFRC52201HN1,115/NXP+Semiconductors/view-part/?ref=eda
U2#1 = DS1307Z+: 64 x 8, Serial, IÂ²C Real-Time Clock; MF: Analog Devices; SnapEDA_Link: https://www.snapeda.com/parts/DS1307Z+/Analog+Devices/view-part/?ref=snap; Package: SOIC-8 Maxim; Value: *; MP: DS1307Z+; Check_prices: https://www.snapeda.com/parts/DS1307Z+/Analog+Devices/view-part/?ref=eda
X1 X2 = CRYSTAL-GENERIC: GENERIC CRYSTAL

## Sheet 07_LTE_GNSS.SchDoc: LTE_GNSS
size 420 x 297 mm; DrawnBy: YILDIRIM_DOGRU
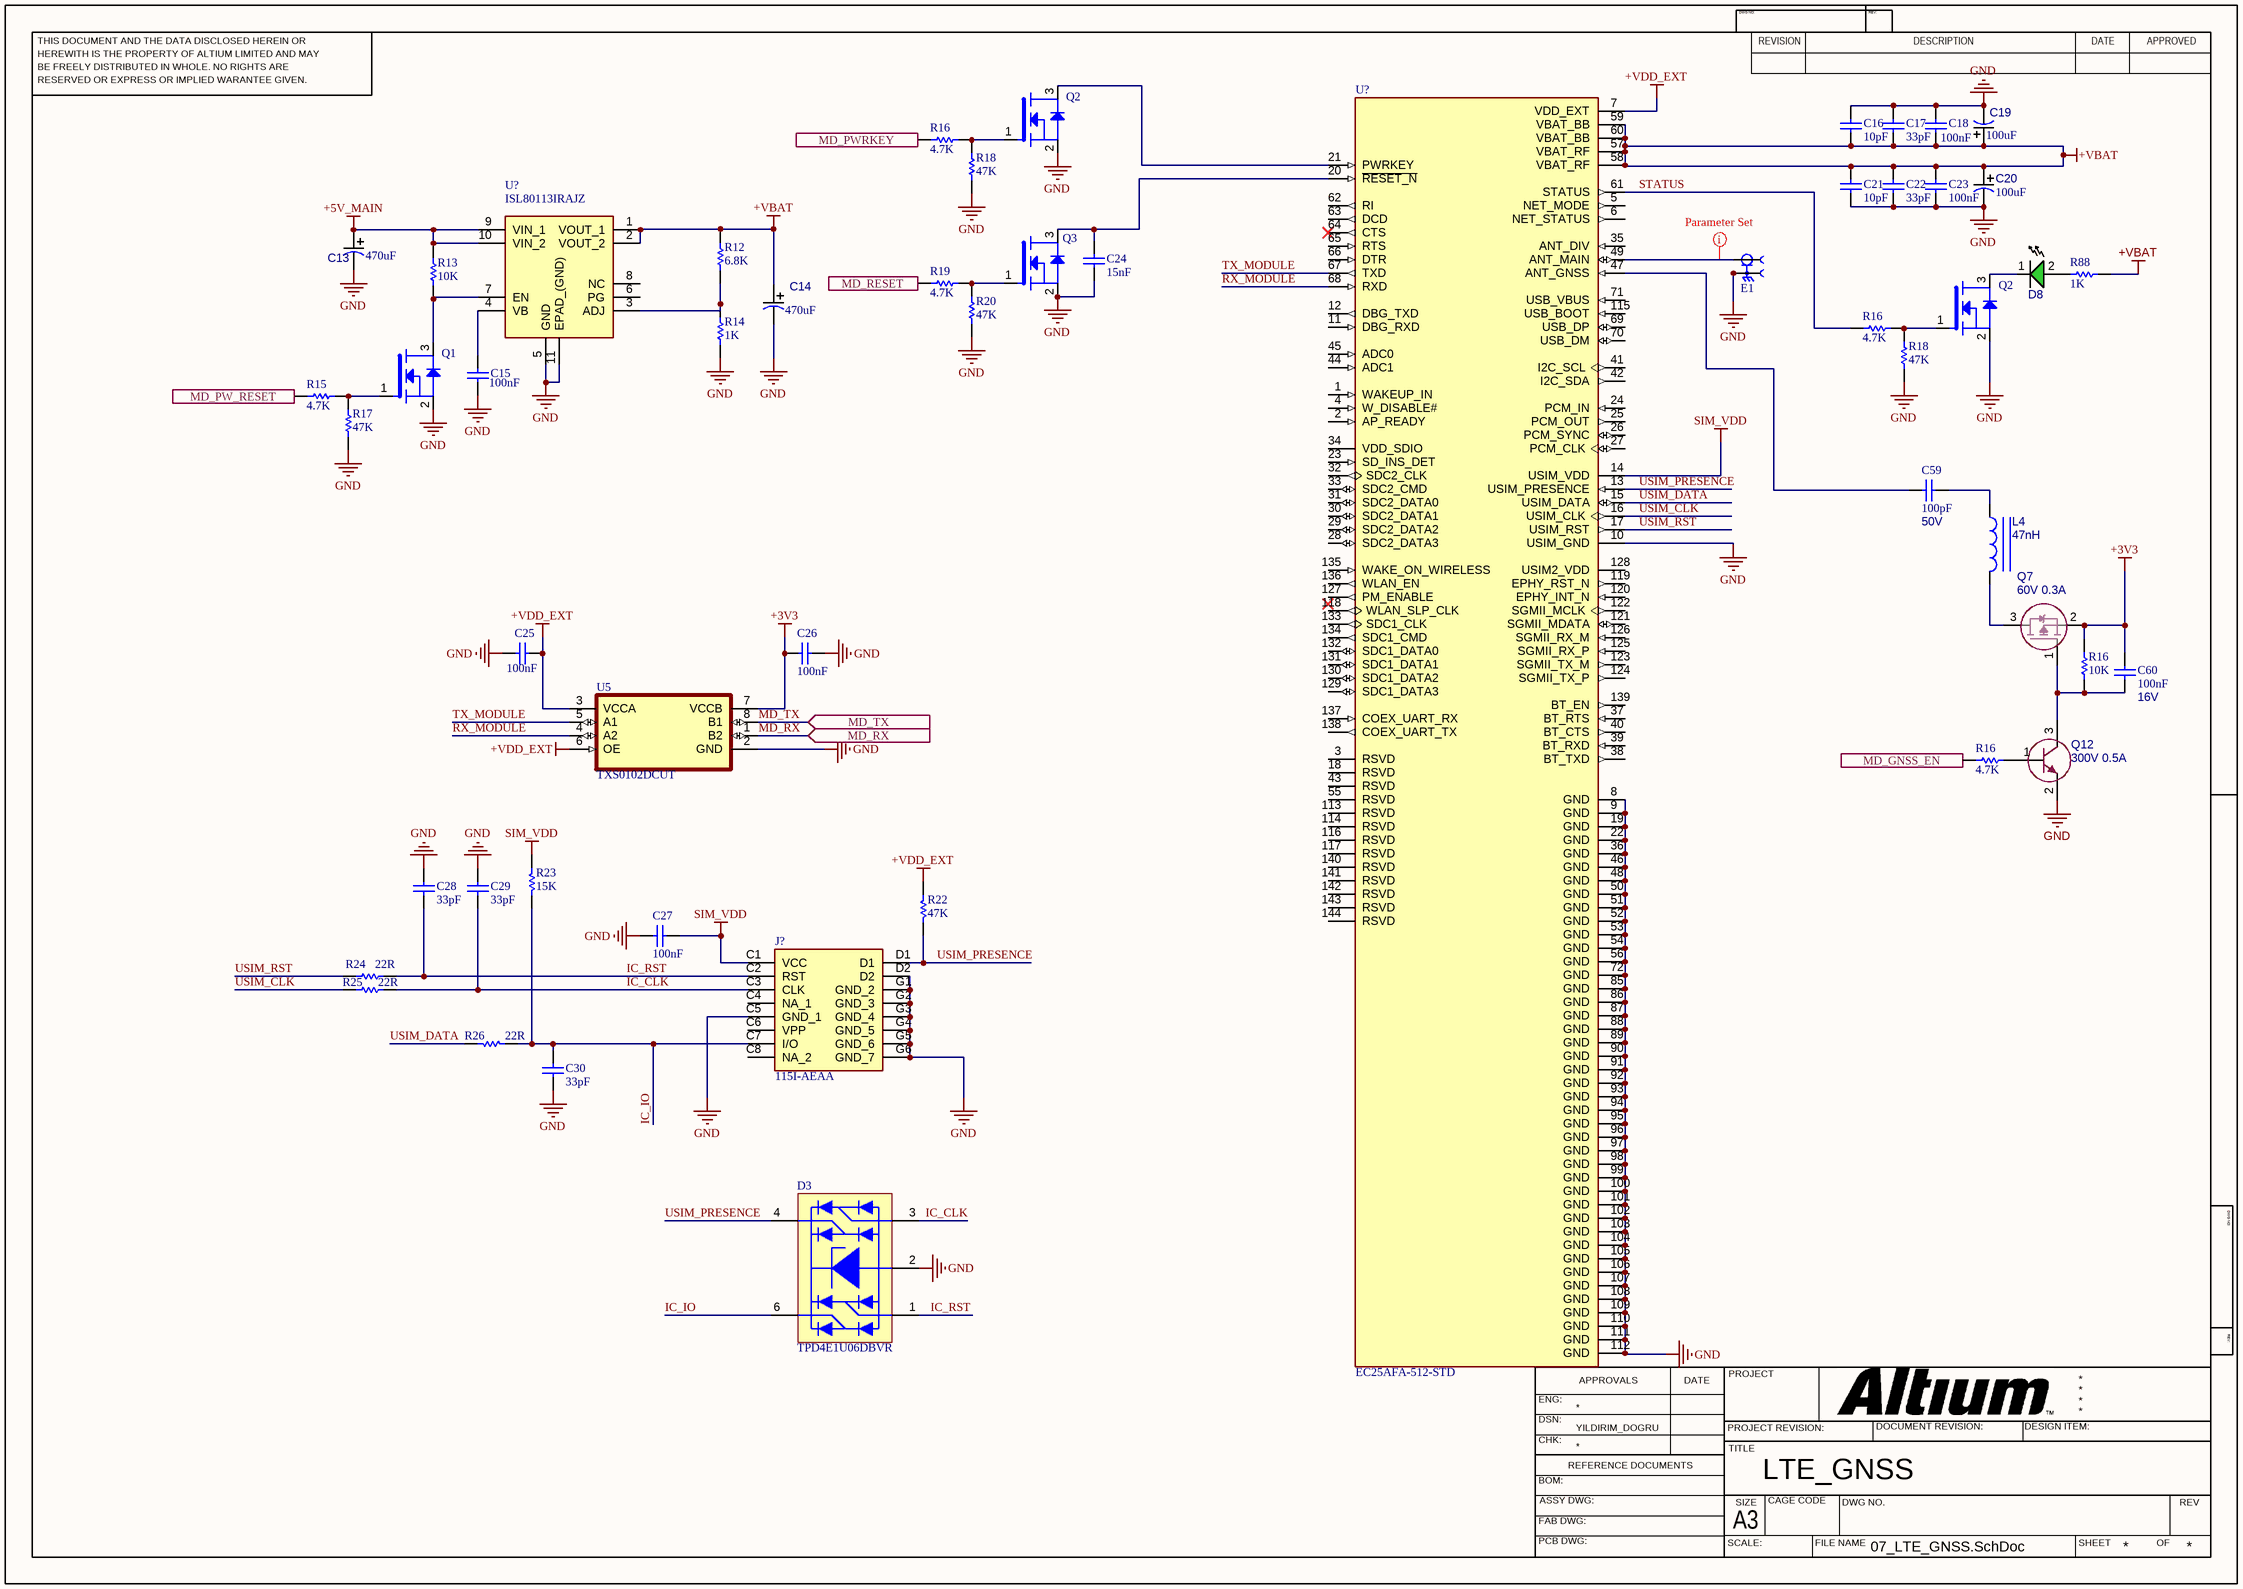
[diagram p7: 07_LTE_GNSS.SchDoc]

### Parts
(Parts that share a designator on the sheet are numbered #1, #2 ... from top to bottom, then left to right.)
C13  value 470uF  [CAP_ELEC_8X10.5 mm]  (hidden comment: MRW-016V471MF105-T/R)
C14  value 470uF  [CAP_ELEC_8X10.5 mm]  (hidden comment: MRW-016V471MF105-T/R)
C15#1  value 100nF  [CAP_0603]  (hidden comment: CL10B104KB8NNNL)
C16  value 10pF  [CAP_0603]  (hidden comment: CL10C100CB8NNNC)
C17  value 33pF  [CAP_0603]  (hidden comment: CL10C330JB8NNNC)
C18  value 100nF  [CAP_0603]  (hidden comment: CL10B104KB8NNNL)
C19  value 100uF  [TANTALIUM_BCASE]  (hidden comment: T491B107K006AT)
C20  value 100uF  [TANTALIUM_BCASE]  (hidden comment: T491B107K006AT)
C21  value 10pF  [CAP_0603]  (hidden comment: CL10C100CB8NNNC)
C22  value 33pF  [CAP_0603]  (hidden comment: CL10C330JB8NNNC)
C23  value 100nF  [CAP_0603]  (hidden comment: CL10B104KB8NNNL)
C24  value 15nF  [CAP_0603]  (hidden comment: CL10B153KB85PNC)
C25  value 100nF  [CAP_0603]  (hidden comment: CL10B104KB8NNNL)
C26  value 100nF  [CAP_0603]  (hidden comment: CL10B104KB8NNNL)
C27  value 100nF  [CAP_0603]  (hidden comment: CL10B104KB8NNNL)
C28#1  value 33pF  [CAP_0603]  (hidden comment: CL10C330JB8NNNC)
C29#1  value 33pF  [CAP_0603]  (hidden comment: CL10C330JB8NNNC)
C30  value 33pF  [CAP_0603]  (hidden comment: CL10C330JB8NNNC)
C59  value 100pF  Voltage: 50V  [CAP_0402]  (hidden comment: CC0402JRNPO9BN101)
C60  value 100nF  Voltage: 16V  [CAP_0402]  (hidden comment: CL05B104KO5NNNC)
D3#2  TPD4E1U06DBVR  [SOT23_6]
D8#1  LTST-C190TGKT  [LED_0603_GREEN]  (value not drawn)
E1  L-KLS1-SMA002-B  [SMA_JACK_90]  (value not drawn)
J?#3  115I-AEAA  [115IAEAA]
L4  value 47nH  [RES_0402]  (hidden comment: LQG15HS47NJ02D)
Q1  BSS138W-7-F  [SOT323]  (value not drawn)
Q2#1  BSS138W-7-F  [SOT323]  (value not drawn)
Q2#2  BSS138W-7-F  [SOT323]  (value not drawn)
Q3  BSS138W-7-F  [SOT323]  (value not drawn)
Q7  value 60V 0.3A  [SOT23]  (hidden comment: PJA3439_R1_00001)
Q12#4  value 300V 0.5A  [SOT-23-3]  (hidden comment: MMBTA42_R1_00001)
R12  value 6.8K  [RES_0603]  (hidden comment: 0603SAF6801T5E)
R13  value 10K  [RES_0603]  (hidden comment: 0603SAF1002T5E)
R14#2  value 1K  [RES_0603]  (hidden comment: 0603SAF1001T5E)
R15#2  value 4.7K  [RES_0603]  (hidden comment: 0603SAF4701T5E)
R16#2  value 4.7K  [RES_0603]  (hidden comment: 0603SAF4701T5E)
R16#3  value 4.7K  [RES_0603]  (hidden comment: 0603SAF4701T5E)
R16#4  value 10K  [RES_0402]  (hidden comment: RC0402JR-0710KL)
R16#5  value 4.7K  [RES_0603]  (hidden comment: 0603SAF4701T5E)
R17  value 47K  [RES_0603]  (hidden comment: 0603SAF4702T5E)
R18#1  value 47K  [RES_0603]  (hidden comment: 0603SAF4702T5E)
R18#2  value 47K  [RES_0603]  (hidden comment: 0603SAF4702T5E)
R19  value 4.7K  [RES_0603]  (hidden comment: 0603SAF4701T5E)
R20#2  value 47K  [RES_0603]  (hidden comment: 0603SAF4702T5E)
R22  value 47K  [RES_0603]  (hidden comment: 0603SAF4702T5E)
R23  value 15K  [RES_0603]  (hidden comment: 0603SAJ0153T5E)
R24  value 22R  [RES_0603]  (hidden comment: 0603SAJ0220T5E)
R25  value 22R  [RES_0603]  (hidden comment: 0603SAJ0220T5E)
R26  value 22R  [RES_0603]  (hidden comment: 0603SAJ0220T5E)
R88  value 1K  [RES_0603]  (hidden comment: RES)
U5#1  TXS0102DCUT  [8_VSSOP]
U?#5  EC25AFA-512-STD  [XCVR_EC25AFA-512-STD]
U?#6  ISL80113IRAJZ  [ISL80101IRAJZ]

### Ports
MD_GNSS_EN (in), MD_PW_RESET (in), MD_PWRKEY (in), MD_RESET (in), MD_RX (in), MD_TX (in)

### Nets
+3V3: C26.1 C60.1 Q7.2(S) R16#4.1 U5#1.7(VCCB)
+5V_MAIN: C13.1 R13.2 U?#6.9(VIN_1) U?#6.10(VIN_2)
+VBAT: C14.1 C16.1 C17.1 C18.1 C19.1 C20.1 C21.2 C22.2 C23.2 R12.2 R88.2 U?#5.57(VBAT_RF) U?#5.58(VBAT_RF) U?#5.59(VBAT_BB) U?#5.60(VBAT_BB) U?#6.1(VOUT_1) U?#6.2(VOUT_2)
+VDD_EXT: C25.1 R22.2 U5#1.3(VCCA) U5#1.6(OE) U?#5.7(VDD_EXT)
GND: C13.2 C14.2 C15#1.1 C16.2 C17.2 C18.2 C19.2 C20.2 C21.1 C22.1 C23.1 C24.1 C25.2 C26.2 C27.2 C28#1.1 C29#1.1 C30.1 D3#2.2 E1.S1 E1.S2 E1.S3 E1.S4 J?#3.C5(GND_1) J?#3.D2 J?#3.G1(GND_2) J?#3.G2(GND_3) J?#3.G3(GND_4) J?#3.G4(GND_5) J?#3.G5(GND_6) J?#3.G6(GND_7) Q1.2(S) Q2#1.2(S) Q2#2.2(S) Q3.2(S) Q12#4.2(E) R14#2.1 R17.1 R18#1.1 R18#2.1 R20#2.1 U5#1.2(GND) U?#5.8(GND) U?#5.9(GND) U?#5.10(USIM_GND) U?#5.19(GND) U?#5.22(GND) U?#5.36(GND) U?#5.46(GND) U?#5.48(GND) U?#5.50(GND) U?#5.51(GND) U?#5.52(GND) U?#5.53(GND) U?#5.54(GND) U?#5.56(GND) U?#5.72(GND) U?#5.85(GND) U?#5.86(GND) U?#5.87(GND) U?#5.88(GND) U?#5.89(GND) U?#5.90(GND) U?#5.91(GND) U?#5.92(GND) U?#5.93(GND) U?#5.94(GND) U?#5.95(GND) U?#5.96(GND) U?#5.97(GND) U?#5.98(GND) U?#5.99(GND) U?#5.100(GND) U?#5.101(GND) U?#5.102(GND) U?#5.103(GND) U?#5.104(GND) U?#5.105(GND) U?#5.106(GND) U?#5.107(GND) U?#5.108(GND) U?#5.109(GND) U?#5.110(GND) U?#5.111(GND) U?#5.112(GND) U?#6.5(GND) U?#6.11(EPAD_(GND))  [project net TVSS]
SIM_VDD: C27.1 J?#3.C1(VCC) R23.2 U?#5.14(USIM_VDD)
IC_CLK: C29#1.2 D3#2.3 J?#3.C3(CLK) R25.2
IC_IO: C30.2 D3#2.6 J?#3.C7(I/O) R23.1 R26.1
IC_RST: C28#1.2 D3#2.1 J?#3.C2(RST) R24.2
MD_RX: U5#1.1(B2) ; port MD_RX
MD_TX: U5#1.8(B1) ; port MD_TX
RX_MODULE: U5#1.4(A2) U?#5.68(RXD)
STATUS: R16#3.1 U?#5.61(STATUS)
TX_MODULE: U5#1.5(A1) U?#5.67(TXD)
USIM_CLK: R25.1 U?#5.16(USIM_CLK)
USIM_DATA: R26.2 U?#5.15(USIM_DATA)
USIM_PRESENCE: D3#2.4 J?#3.D1 R22.1 U?#5.13(USIM_PRESENCE)
USIM_RST: R24.1 U?#5.17(USIM_RST)
NetC15#1_2: C15#1.2 U?#6.4(VB)
NetC24_2: C24.2 Q3.3(D) U?#5.20(~{RESET_N})
NetC59_1: C59.1 L4.1
NetC59_2: C59.2 U?#5.47(ANT_GNSS)
NetC60_2: C60.2 Q7.1(G) Q12#4.3(C) R16#4.2
NetD8#1_1: D8#1.1 Q2#2.3(D)
NetD8#1_2: D8#1.2 R88.1
NetE1_1: E1.1 U?#5.49(ANT_MAIN)
NetL4_2: L4.2 Q7.3(D)
NetQ1_1: Q1.1(G) R15#2.2 R17.2
NetQ1_3: Q1.3(D) R13.1 U?#6.7(EN)
NetQ2#1_1: Q2#1.1(G) R16#2.2 R18#1.2
NetQ2#1_3: Q2#1.3(D) U?#5.21(PWRKEY)
NetQ2#2_1: Q2#2.1(G) R16#3.2 R18#2.2
NetQ3_1: Q3.1(G) R19.2 R20#2.2
NetQ12#4_1: Q12#4.1(B) R16#5.2
NetR12_1: R12.1 R14#2.2 U?#6.3(ADJ)
NetR15#2_1: R15#2.1 ; port MD_PW_RESET
NetR16#2_1: R16#2.1 ; port MD_PWRKEY
NetR16#5_1: R16#5.1 ; port MD_GNSS_EN
NetR19_1: R19.1 ; port MD_RESET

Not connected (* = marked no-connect by the designer): J?#3 C4(NA_1) C6(VPP) C8(NA_2); U?#5 1(WAKEUP_IN) 2(AP_READY) 3(RSVD) 4(W_DISABLE#) 5(NET_MODE) 6(NET_STATUS) 11(DBG_RXD) 12(DBG_TXD) 18(RSVD) 23(SD_INS_DET) 24(PCM_IN) 25(PCM_OUT) 26(PCM_SYNC) 27(PCM_CLK) 28(SDC2_DATA3) 29(SDC2_DATA2) 30(SDC2_DATA1) 31(SDC2_DATA0) 32(SDC2_CLK) 33(SDC2_CMD) 34(VDD_SDIO) 35(ANT_DIV) 37(BT_RTS) 38(BT_TXD) 39(BT_RXD) 40(BT_CTS) 41(I2C_SCL) 42(I2C_SDA) 43(RSVD) 44(ADC1) 45(ADC0) 55(RSVD) 62(RI) 63(DCD) 64(CTS)* 65(RTS) 66(DTR) 69(USB_DP) 70(USB_DM) 71(USB_VBUS) 113(RSVD) 114(RSVD) 115(USB_BOOT) 116(RSVD) 117(RSVD) 118(WLAN_SLP_CLK) 119(EPHY_RST_N) 120(EPHY_INT_N) 121(SGMII_MDATA) 122(SGMII_MCLK) 123(SGMII_TX_M) 124(SGMII_TX_P) 125(SGMII_RX_P) 126(SGMII_RX_M) 127(PM_ENABLE) 128(USIM2_VDD) 129(SDC1_DATA3) 130(SDC1_DATA2) 131(SDC1_DATA1) 132(SDC1_DATA0) 133(SDC1_CLK) 134(SDC1_CMD) 135(WAKE_ON_WIRELESS) 136(WLAN_EN) 137(COEX_UART_RX) 138(COEX_UART_TX) 139(BT_EN) 140(RSVD) 141(RSVD) 142(RSVD) 143(RSVD) 144(RSVD); U?#6 6(PG) 8(NC)

### Layout directives
rule Width Constraint [Pref Width = 0.389mm    Min Width = 0.254mm    Max Width = 0.389mm]: NetE1_1

### Notes on the sheet
- THIS DOCUMENT AND THE DATA DISCLOSED HEREIN OR
- HEREWITH IS THE PROPERTY OF ALTIUM LIMITED AND MAY
- DWG NO:
- REVISION
- REV:
- DESCRIPTION
- DATE
- APPROVED
- BE FREELY DISTRIBUTED IN WHOLE. NO RIGHTS ARE
- RESERVED OR EXPRESS OR IMPLIED WARANTEE GIVEN.
- ENG:
- APPROVALS
- PROJECT
- DSN:
- CHK:
- REFERENCE DOCUMENTS
- PROJECT REVISION:
- TITLE
- DOCUMENT REVISION:
- DESIGN ITEM:
- BOM:
- FAB DWG:
- PCB DWG:
- ASSY DWG:
- SCALE:
- A3
- SIZE
- CAGE CODE
- FILE NAME
- DWG NO.
- SHEET
- OF
- REV

### Library data of the parts
C13 C14 = MRW-016V471MF105-T/R: CAP.EL.470uF 16V 8x10.5 105C 2000Hrs SMD; Manufacturer: KOSHIN; Manufacturer Part Number: MRW-016V471MF105-T/R; Supplier 1: Ozdisan
C15#1 C18 C23 C25-C27 = CL10B104KB8NNNL: as C?#13 on sheet 03_Vehicle_Interfaces; Supplier 1: OZDISAN; Manufacturer Part Number: CL10B104KB8NNNL
C16 C21 = CL10C100CB8NNNC: MLCC (1608) 0603 10pF 50VDC ±0.25pF C0G (NP0); Manufacturer: SAMSUNG; Supplier 1: Ozdisan; Manufacturer Part Number: CL10C100CB8NNNC
C17 C22 C28#1 C29#1 C30 = CL10C330JB8NNNC: MLCC (1608) 0603 33pF 50VDC ±5% C0G (NP0); Manufacturer: Samsung Electro-Mechanics America, Inc; Supplier 1: OZDISAN; Manufacturer Part Number: CL10C330JB8NNNC
C19 C20 = T491B107K006AT: CAP.TANTAL 100uF 6.3V 10% B CASE (3528) SMD KEMET; Manufacturer: KEMET; Manufacturer Part Number: T491B107K006AT; Supplier 1: Ozdisan
C24 = CL10B153KB85PNC: as C?#15 on sheet 03_Vehicle_Interfaces; Supplier 1: OZDISAN; Manufacturer Part Number: CL10B153KB85PNC
C59 = CL10B103KB8NNNL: as C?#11 on sheet 03_Vehicle_Interfaces; Manufacturer Part Number: CC0402JRNPO9BN101
C60 = CL10B103KB8NNNL: MLCC (1005) 0402 100nF 16VDC ±10% X7R; Manufacturer: SAMSUNG; Manufacturer Part Number: CL05B104KO5NNNC
D3#2 = TPD4E1U06DBVR: DIODE TVS 45W 15V SOT23-6; Manufacturer: TEXAS; Value: *; Supplier 1: OZDISAN; Manufacturer Part Number: TPD4E1U06DBVR
D8#1 = LTST-C190TGKT: LED SMD 0603 GREEN 71-450mcd 130° WATER CLEAR; Manufacturer: LITEON; Package: 0603(1608 Metric); Manufacturer Part Number: LTST-C190TGKT; Value: GREEN
E1 = L-KLS1-SMA002-B: CONNECTOR ANTENNA SMA JACK R/A 50M; Manufacturer: KLS ELECTRONIC; Manufacturer Part Number: L-KLS1-SMA002-B; Supplier 1: OZDISAN
J?#3 = 115I-AEAA: Connector; Manufacturer_Name: ATTEND; Datasheet Link: https://www.attend.com.tw/data/download/file/115I-AEAA.pdf; Height: 1.52mm; Manufacturer_Part_Number: 115I-AEAA
L4 = CBC3225T100MR: INDUCTOR FIXED 0402 47nH 300mA SMD; Manufacturer: MURATA; Package: 0402 (1005 Metric); Manufacturer Part Number: LQG15HS47NJ02D
Q1 Q2#1 Q2#2 Q3 = BSS138W-7-F: MOSFET DIS.200mA 50V N-CH SC70-3; Manufacturer: DIODES; Value: *; Supplier 1: OZDISAN; Manufacturer Part Number: BSS138W-7-F
Q7 = PJA3439_R1_00001: MOSFET P-CH 60V 300mA SOT23 SMT; Manufacturer: Panjit International Inc.; Package: SOT23; Manufacturer Part Number: PJA3439_R1_00001; Supplier Part Number 1: 3757-PJA3439_R1_00001TR-ND; Supplier Part Number 2: 241-PJA3439_R1_00001; Supplier Part Number 3: PJA3439_R1_00001; Supplier 1: DIGIKEY; Supplier 2: MOUSER; Supplier 3: OZDISAN
Q12#4 = MMBTA42_R1_00001: as Q12#1 on sheet 01_Power_Protection; Package: SOT23; Supplier Part Number 1: 3757-MMBTA42_R1_00001CT-ND; Supplier Part Number 2: *; Supplier Part Number 3: MMBTA42_R1_00001; Supplier 1: DIGIKEY; Supplier 2: MOUSER; Supplier 3: OZDISAN; Manufacturer Part Number: MMBTA42_R1_00001
R12 = 0603SAF6801T5E: RES.(1608) 0603 6.8K Ohms 1% 1/10W-S 100PPM; Manufacturer: ROYALOHM; Supplier 1: Ozdisan; Manufacturer Part Number: 0603SAF6801T5E
R13 = 0603SAF1002T5E: RES.(1608) 0603 10K Ohms 1% 1/10W-S 100PPM; Manufacturer: ROYALOHM; Supplier 1: Ozdisan; Manufacturer Part Number: 0603SAF1002T5E
R14#2 = 0603SAF1001T5E: as R14#1 on sheet 05_Taxi_Toplight; Supplier 1: Ozdisan; Manufacturer Part Number: 0603SAF1001T5E
R15#2 R16#2 R16#3 R16#5 R19 = 0603SAF4701T5E: RES.(1608) 0603 4.7K Ohms 1% 1/10W-S 100PPM; Manufacturer: ROYALOHM; Supplier 1: Ozdisan; Manufacturer Part Number: 0603SAF4701T5E
R16#4 = R03000: as R?#5 on sheet 01_Power_Protection; Manufacturer Part Number: RC0402JR-0710KL
R17 R18#1 R18#2 R20#2 R22 = 0603SAF4702T5E: as R?#3 on sheet 01_Power_Protection; Supplier 1: Ozdisan; Manufacturer Part Number: 0603SAF4702T5E
R23 = 0603SAJ0153T5E: RES.(1608) 0603 15K Ohms 5% 1/10W-S 100PPM; Manufacturer: ROYALOHM; Supplier 1: Ozdisan; Manufacturer Part Number: 0603SAJ0153T5E
R24-R26 = 0603SAJ0220T5E: as R?#22 on sheet 05_Taxi_Toplight; Supplier 1: Ozdisan; Manufacturer Part Number: 0603SAJ0220T5E
R88 = R02998: RES 0603 1K Ohms 1% 1/10W-S 100PPM; Manufacturer: ROYALOHM; Manufacturer Part Number: 0603SAF1001T5E
U5#1 = TXS0102DCUT: Voltage Level Translator Bidirectional 1 Circuit 2 Channel 24Mbps 8-VSSOP; Manufacturer: Texas Instruments; Value: *; Supplier 1: DIGIKEY; Manufacturer Part Number: TXS0102DCUT
U?#5 = EC25AFA-512-STD: Quectel EC25 is a series of 4G - LTE Cat 4 module optimized specially for M2M and IoT applications.; Availability: In Stock; Package: Custom Quectel; MP: EC25AFA-512-STD; SnapEDA_Link: https://www.snapeda.com/parts/EC25AFA-512-STD/Quectel/view-part/?ref=snap; MF: Quectel; Purchase-URL: https://pricing.snapeda.com/search/part/EC25AFA-512-STD/?ref=eda; Value: *; Check_prices: https://www.snapeda.com/parts/EC25AFA-512-STD/Quectel/view-part/?ref=eda; Price: None
U?#6 = ISL80113IRAJZ: Linear Voltage Regulator IC Positive Adjustable 1 Output 3A 10-DFN (3x3); Manufacturer: Renesas Electronics Corporation; Value: IC REG LINEAR POS ADJ 3A 10DFN; Supplier 1: DIGIKEY; Manufacturer Part Number: ISL80113IRAJZ

## Sheet 08_Display.SchDoc: Display
size A4; DrawnBy: YILDIRIM_DOGRU
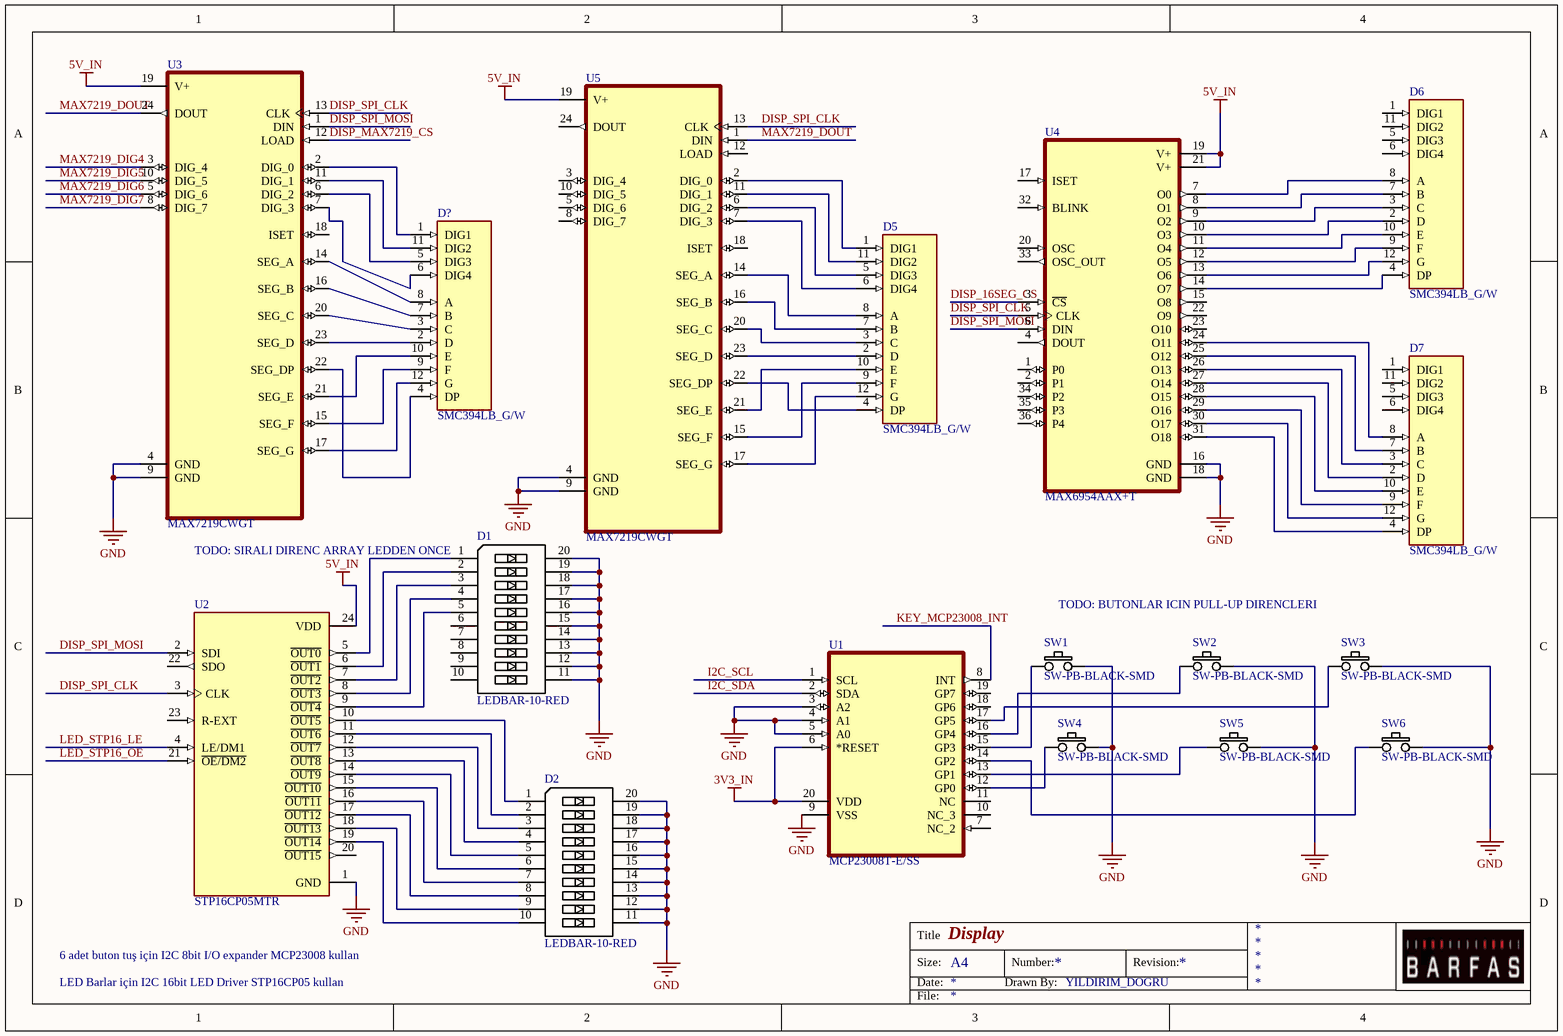
[diagram p8: 08_Display.SchDoc]

### Parts
(Parts that share a designator on the sheet are numbered #1, #2 ... from top to bottom, then left to right.)
D1#3  LEDBAR-10-RED  [LEDBAR-10-RED]
D2#2  LEDBAR-10-RED  [LEDBAR-10-RED]
D5  SMC394LB_G/W  [LED_SMC394LB_G/W]
D6  SMC394LB_G/W  [LED_SMC394LB_G/W]
D7  SMC394LB_G/W  [LED_SMC394LB_G/W]
D?#10  SMC394LB_G/W  [LED_SMC394LB_G/W]
SW1#2  SW-PB-BLACK-SMD  [SW-PB-SMD]
SW2  SW-PB-BLACK-SMD  [SW-PB-SMD]
SW3  SW-PB-BLACK-SMD  [SW-PB-SMD]
SW4  SW-PB-BLACK-SMD  [SW-PB-SMD]
SW5  SW-PB-BLACK-SMD  [SW-PB-SMD]
SW6  SW-PB-BLACK-SMD  [SW-PB-SMD]
U1#2  MCP23008T-E/SS  [SOP65P780X200-20N]
U2#2  STP16CP05MTR  [SOIC127P1032X265-24N]
U3  MAX7219CWGT  [SOIC127P1032X265-24N]
U4  MAX6954AAX+T  [SOP80P1033X265-36N]
U5#2  MAX7219CWGT  [SOIC127P1032X265-24N]

### Nets
3V3_IN: U1#2.6(*RESET) U1#2.20(VDD)
5V_IN: U2#2.24(VDD) U3.19(V+) U4.19(V+) U4.21(V+) U5#2.19(V+)
GND: D1#3.11 D1#3.12 D1#3.13 D1#3.14 D1#3.15 D1#3.16 D1#3.17 D1#3.18 D1#3.19 D1#3.20 D2#2.11 D2#2.12 D2#2.13 D2#2.14 D2#2.15 D2#2.16 D2#2.17 D2#2.18 D2#2.19 D2#2.20 SW1#2.2 SW2.2 SW3.2 SW4.2 SW5.2 SW6.2 U1#2.3(A2) U1#2.4(A1) U1#2.5(A0) U1#2.9(VSS) U2#2.1(GND) U3.4(GND) U3.9(GND) U4.16(GND) U4.18(GND) U5#2.4(GND) U5#2.9(GND)  [project net TVSS]
DISP_16SEG_CS: U4.3(~{CS})
DISP_MAX7219_CS: U3.12(LOAD)
DISP_SPI_CLK: U2#2.3(CLK) U3.13(CLK) U4.5(CLK) U5#2.13(CLK)
DISP_SPI_MOSI: U2#2.2(SDI) U3.1(DIN) U4.6(DIN)
I2C_SCL: U1#2.1(SCL)
I2C_SDA: U1#2.2(SDA)
KEY_MCP23008_INT: U1#2.8(INT)
LED_STP16_LE: U2#2.4(LE/DM1)
LED_STP16_OE: U2#2.21(~{OE/DM2})
MAX7219_DIG4: U3.3(DIG_4)
MAX7219_DIG5: U3.10(DIG_5)
MAX7219_DIG6: U3.5(DIG_6)
MAX7219_DIG7: U3.8(DIG_7)
MAX7219_DOUT: U3.24(DOUT) U5#2.1(DIN)
NetD1#3_1: D1#3.1 U2#2.5(~{OUT0})
NetD1#3_2: D1#3.2 U2#2.6(~{OUT1})
NetD1#3_3: D1#3.3 U2#2.7(~{OUT2})
NetD1#3_4: D1#3.4 U2#2.8(~{OUT3})
NetD1#3_5: D1#3.5 U2#2.9(~{OUT4})
NetD2#2_1: D2#2.1 U2#2.10(~{OUT5})
NetD2#2_2: D2#2.2 U2#2.11(~{OUT6})
NetD2#2_3: D2#2.3 U2#2.12(~{OUT7})
NetD2#2_4: D2#2.4 U2#2.13(~{OUT8})
NetD2#2_5: D2#2.5 U2#2.14(~{OUT9})
NetD2#2_6: D2#2.6 U2#2.15(~{OUT10})
NetD2#2_7: D2#2.7 U2#2.16(~{OUT11})
NetD2#2_8: D2#2.8 U2#2.17(~{OUT12})
NetD2#2_9: D2#2.9 U2#2.18(~{OUT13})
NetD2#2_10: D2#2.10 U2#2.19(~{OUT14})
NetD5_1: D5.1(DIG1) U5#2.2(DIG_0)
NetD5_2: D5.2(D) U5#2.23(SEG_D)
NetD5_3: D5.3(C) U5#2.20(SEG_C)
NetD5_4: D5.4(DP) U5#2.22(SEG_DP)
NetD5_5: D5.5(DIG3) U5#2.6(DIG_2)
NetD5_6: D5.6(DIG4) U5#2.7(DIG_3)
NetD5_7: D5.7(B) U5#2.16(SEG_B)
NetD5_8: D5.8(A) U5#2.14(SEG_A)
NetD5_9: D5.9(F) U5#2.15(SEG_F)
NetD5_10: D5.10(E) U5#2.21(SEG_E)
NetD5_11: D5.11(DIG2) U5#2.11(DIG_1)
NetD5_12: D5.12(G) U5#2.17(SEG_G)
NetD6_2: D6.2(D) U4.10(O3)
NetD6_3: D6.3(C) U4.9(O2)
NetD6_4: D6.4(DP) U4.14(O7)
NetD6_7: D6.7(B) U4.8(O1)
NetD6_8: D6.8(A) U4.7(O0)
NetD6_9: D6.9(F) U4.12(O5)
NetD6_10: D6.10(E) U4.11(O4)
NetD6_12: D6.12(G) U4.13(O6)
NetD7_2: D7.2(D) U4.27(O14)
NetD7_3: D7.3(C) U4.26(O13)
NetD7_4: D7.4(DP) U4.31(O18)
NetD7_7: D7.7(B) U4.25(O12)
NetD7_8: D7.8(A) U4.24(O11)
NetD7_9: D7.9(F) U4.29(O16)
NetD7_10: D7.10(E) U4.28(O15)
NetD7_12: D7.12(G) U4.30(O17)
NetD?#10_1: D?#10.1(DIG1) U3.2(DIG_0)
NetD?#10_2: D?#10.2(D) U3.23(SEG_D)
NetD?#10_3: D?#10.3(C) U3.20(SEG_C)
NetD?#10_4: D?#10.4(DP) U3.22(SEG_DP)
NetD?#10_5: D?#10.5(DIG3) U3.6(DIG_2)
NetD?#10_6: D?#10.6(DIG4) U3.7(DIG_3)
NetD?#10_7: D?#10.7(B) U3.16(SEG_B)
NetD?#10_8: D?#10.8(A) U3.14(SEG_A)
NetD?#10_9: D?#10.9(F) U3.15(SEG_F)
NetD?#10_10: D?#10.10(E) U3.21(SEG_E)
NetD?#10_11: D?#10.11(DIG2) U3.11(DIG_1)
NetD?#10_12: D?#10.12(G) U3.17(SEG_G)
NetSW1#2_1: SW1#2.1 U1#2.15(GP3)
NetSW2_1: SW2.1 U1#2.16(GP4)
NetSW3_1: SW3.1 U1#2.17(GP5)
NetSW4_1: SW4.1 U1#2.12(GP0)
NetSW5_1: SW5.1 U1#2.13(GP1)
NetSW6_1: SW6.1 U1#2.14(GP2)

Not connected (* = marked no-connect by the designer): D1#3 6 7 8 9 10; D6 1(DIG1) 5(DIG3) 6(DIG4) 11(DIG2); D7 1(DIG1) 5(DIG3) 6(DIG4) 11(DIG2); U1#2 7(NC_2) 10(NC_3) 11(NC) 18(GP6) 19(GP7); U2#2 20(~{OUT15}) 22(SDO) 23(R-EXT); U3 18(ISET); U4 1(P0) 2(P1) 4(DOUT) 15(O8) 17(ISET) 20(OSC) 22(O9) 23(O10) 32(BLINK) 33(OSC_OUT) 34(P2) 35(P3) 36(P4); U5#2 3(DIG_4) 5(DIG_6) 8(DIG_7) 10(DIG_5) 12(LOAD) 18(ISET) 24(DOUT)

### Notes on the sheet
- TODO: SIRALI DIRENC ARRAY LEDDEN ONCE
- TODO: BUTONLAR ICIN PULL-UP DIRENCLERI
- LED Barlar için I2C 16bit LED Driver STP16CP05 kullan
- 6 adet buton tuş için I2C 8bit I/O expander MCP23008 kullan
- Title
- Size:
- Date:
- A4
- Drawn By:
- Number:
- Revision:
- File:

### Library data of the parts
SW1#2 SW2-SW6 = SW-PB-BLACK-SMD: PUSHBUTTON SWITCH 6MM SMD
U1#2 = MCP23008T-E/SS: Extenseur d'entrÃ©es/sorties 8 bits, interface I2C 20 SSOP 0,209 po T/R ¦ Microchip Technology Inc. MCP23008T-E/SS; SnapEDA_Link: https://www.snapeda.com/parts/MCP23008T-E/SS/Microchip/view-part/?ref=snap; Package: SSOP-20 Microchip; Value: *; MF: Microchip; MP: MCP23008T-E/SS; Check_prices: https://www.snapeda.com/parts/MCP23008T-E/SS/Microchip/view-part/?ref=eda
U3 U5#2 = MAX7219CWGT: IC DRVR 7 SEGMNT 8 DIGIT 24SOIC; MF: Analog Devices; MP: MAX7219CWG+; SnapEDA_Link: https://www.snapeda.com/parts/MAX7219CWG+/Analog+Devices/view-part/?ref=snap; Package: SOIC-24 Maxim; Value: *; Check_prices: https://www.snapeda.com/parts/MAX7219CWG+/Analog+Devices/view-part/?ref=eda
U4 = MAX6954AAX+T: MF: {'manufacturer': u'Analog Devices Inc./Maxim Integrated'}; Package: None; Price: None; Value: *; MP: MAX6954AAX+T; Availability: Unavailable
D1#3 D2#2 = LEDBAR-10-RED: Supplier 1: Mouser; Supplier Part Number 1: 604-DC10GWA
D5-D7 D?#10 = SMC394LB_G/W: Package: None; Price: None; Value: *; MP: SMC394LB_G/W; Availability: Unavailable
U2#2 = STP16CP05MTR: Package: None; Price: None; Value: *; MP: STP16CP05MTR; Availability: Unavailable